# EAGLE design CANShield (EAGLE 7.3.0)

## Sheet 1 of 10
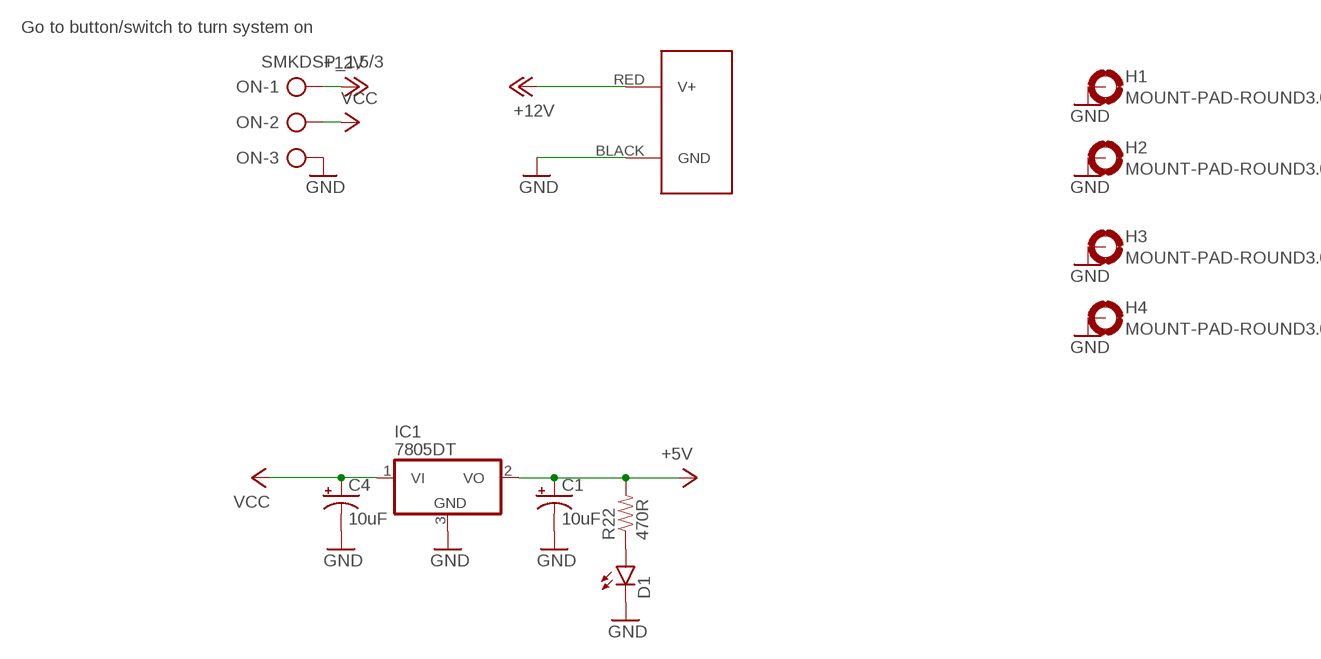
[diagram p0: schematic, sheet 1]

### Parts
C1  10uF  CAP_POLC  [PANASONIC_C]
C4  10uF  CAP_POLC  [PANASONIC_C]
D1  LED1206  [LED-1206]
H1  MOUNT-PAD-ROUND3.0  [3,0-PAD]
H2  MOUNT-PAD-ROUND3.0  [3,0-PAD]
H3  MOUNT-PAD-ROUND3.0  [3,0-PAD]
H4  MOUNT-PAD-ROUND3.0  [3,0-PAD]
IC1  7805DT  [TO252]
J2  POWERPOLE_POWER25A_HORIZONTAL_G2  [POWERPOLE_PAIR_25A_HORIZ_G2]
ON  SMKDSP_1,5/3  [SMKDSP_1,5/3]
R22  470R  RESISTOR0603-RES  [0603-RES]

### Nets
+5V: C1.+ IC1.2(VO) R22.2 ; also sheet 2,3,4,6,7,9,10
+12V: J2.RED(V+) ON.1 ; also sheet 3,5,8,10
GND: C1.- C4.- D1.C H1.B3,0(MOUNT) H2.B3,0(MOUNT) H3.B3,0(MOUNT) H4.B3,0(MOUNT) IC1.3(GND) J2.BLACK(GND) ON.3 ; also sheet 2,3,4,5,6,7,8,9,10
N$16: D1.A R22.1
VCC: C4.+ IC1.1(VI) ON.2

### Notes on the sheet
- Go to button/switch to turn system on

## Sheet 2 of 10
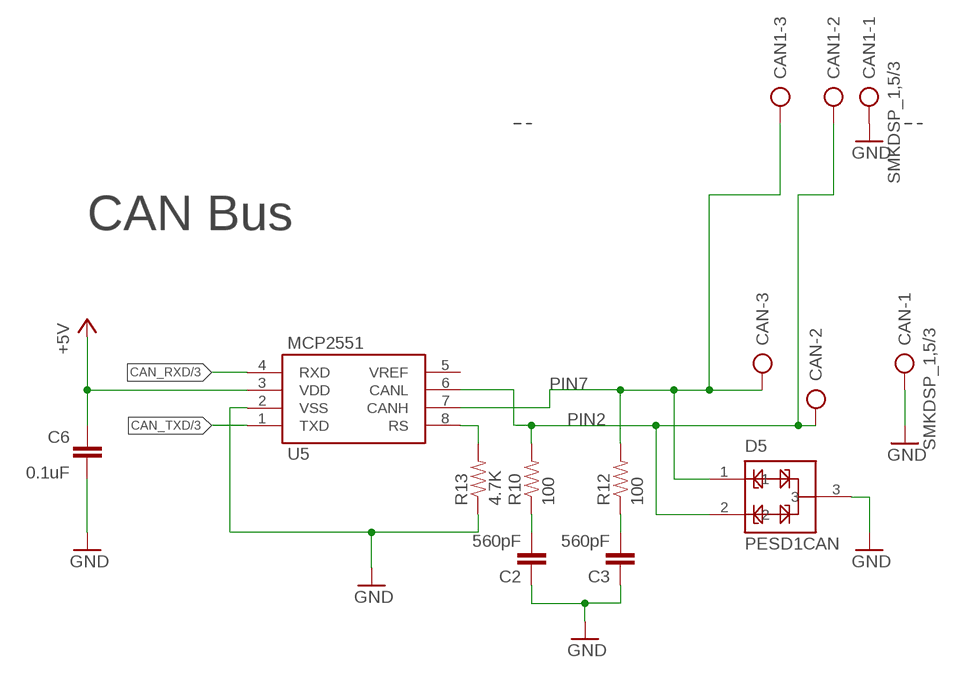
[diagram p1: schematic, sheet 2]

### Parts
C2  560pF  560PF-50V-5%(0603)  [0603-CAP]
C3  560pF  560PF-50V-5%(0603)  [0603-CAP]
C6  0.1uF  0.1UF-25V(+80/-20%)(0603)  [0603-CAP]
CAN  SMKDSP_1,5/3  [SMKDSP_1,5/3]
CAN1  SMKDSP_1,5/3  [SMKDSP_1,5/3]
D5  PESD1CAN  [SOT23-3@1]
R10  100  100OHM-1/10W-1%(0603)  [0603-RES@1]
R12  100  100OHM-1/10W-1%(0603)  [0603-RES@1]
R13  4.7K  4.7KOHM-1/10W-1%(0603)  [0603-RES@1]
U5  MCP2551  [SO08]

### Nets
+5V: C6.2 U5.3(VDD) ; also sheet 1,3,4,6,7,9,10
CAN_RXD: U5.4(RXD) ; also sheet 3
CAN_TXD: U5.1(TXD) ; also sheet 3
GND: C2.1 C3.1 C6.1 CAN1.1 CAN.1 D5.3 R13.1 U5.2(VSS) ; also sheet 1,3,4,5,6,7,8,9,10
N$9: C2.2 R10.1
N$10: C3.2 R12.1
N$14: R13.2 U5.8(RS)
PIN2: CAN1.2 CAN.2 D5.2 R10.2 U5.6(CANL)
PIN7: CAN1.3 CAN.3 D5.1 R12.2 U5.7(CANH)
Unconnected: U5.5(VREF)

### Notes on the sheet
- CAN Bus

## Sheet 3 of 10
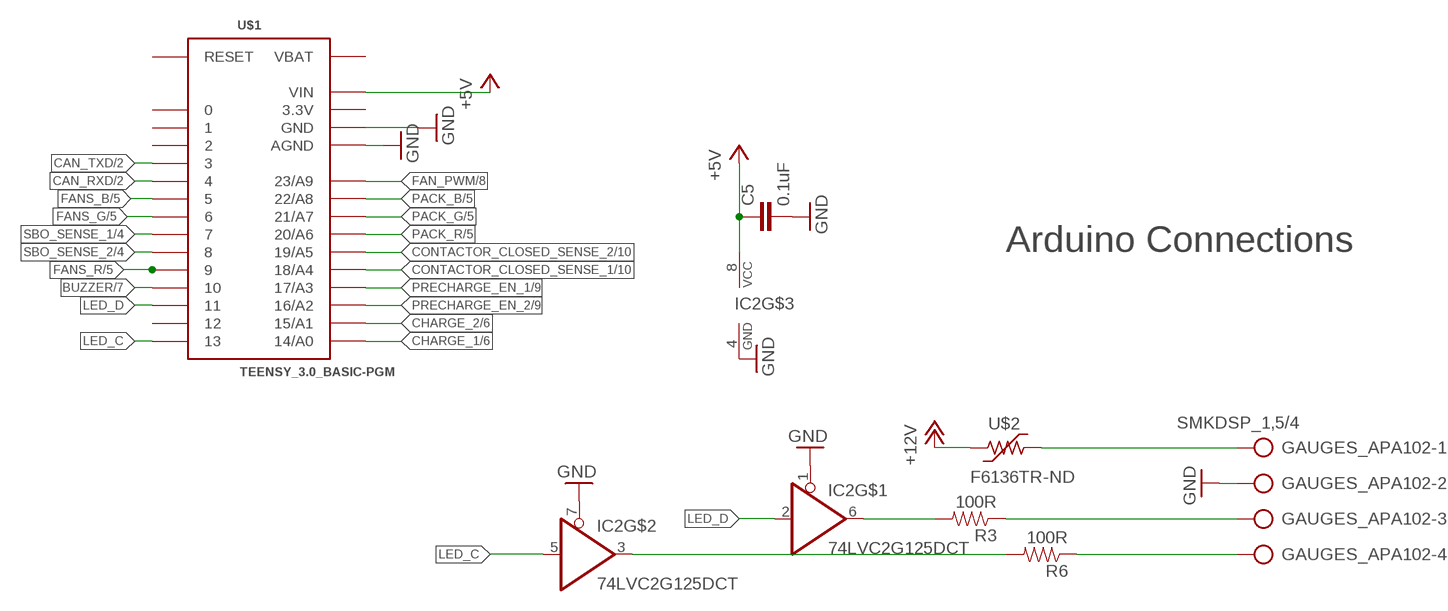
[diagram p2: schematic, sheet 3]

### Parts
C5  0.1uF  CAP0603-CAP  [0603-CAP]
GAUGES_APA102  SMKDSP_1,5/4  [SMKDSP_1,5/4]
IC2  74LVC2G125DCT  [SSOP08]
R3  100R  RESISTOR0603-RES  [0603-RES]
R6  100R  RESISTOR0603-RES  [0603-RES]
U$1  TEENSY_3.0_BASIC-PGM  [TEENSY_3.0_BASIC-PGM]
U$2  F6136TR-ND  PTC-2920L  [2920L]

### Nets
+5V: C5.1 IC2.8(VCC) U$1.VIN ; also sheet 1,2,4,6,7,9,10
+12V: U$2.1 ; also sheet 1,5,8,10
BUZZER: U$1.10 ; also sheet 7
CAN_RXD: U$1.4 ; also sheet 2
CAN_TXD: U$1.3 ; also sheet 2
CHARGE_1: U$1.14/A0 ; also sheet 6
CHARGE_2: U$1.15/A1 ; also sheet 6
CONTACTOR_CLOSED_SENSE_1: U$1.18/A4 ; also sheet 10
CONTACTOR_CLOSED_SENSE_2: U$1.19/A5 ; also sheet 10
FAN_PWM: U$1.23/A9 ; also sheet 8
FANS_B: U$1.5 ; also sheet 5
FANS_G: U$1.6 ; also sheet 5
FANS_R: U$1.9 ; also sheet 5
GND: C5.2 GAUGES_APA102.2 IC2.1(OE) IC2.4(GND) IC2.7(OE) U$1.AGND U$1.GND U$1.GND1(GND) ; also sheet 1,2,4,5,6,7,8,9,10
LED_C: IC2.5(I) U$1.13
LED_D: IC2.2(I) U$1.11
N$2: IC2.3(O) R6.2
N$3: GAUGES_APA102.3 R3.1
N$5: GAUGES_APA102.4 R6.1
N$17: IC2.6(O) R3.2
N$29: GAUGES_APA102.1 U$2.2
PACK_B: U$1.22/A8 ; also sheet 5
PACK_G: U$1.21/A7 ; also sheet 5
PACK_R: U$1.20/A6 ; also sheet 5
PRECHARGE_EN_1: U$1.17/A3 ; also sheet 9
PRECHARGE_EN_2: U$1.16/A2 ; also sheet 9
SBO_SENSE_1: U$1.7 ; also sheet 4
SBO_SENSE_2: U$1.8 ; also sheet 4
Unconnected: U$1.0 U$1.1 U$1.2 U$1.12 U$1.RESET

### Notes on the sheet
- Arduino Connections

## Sheet 4 of 10
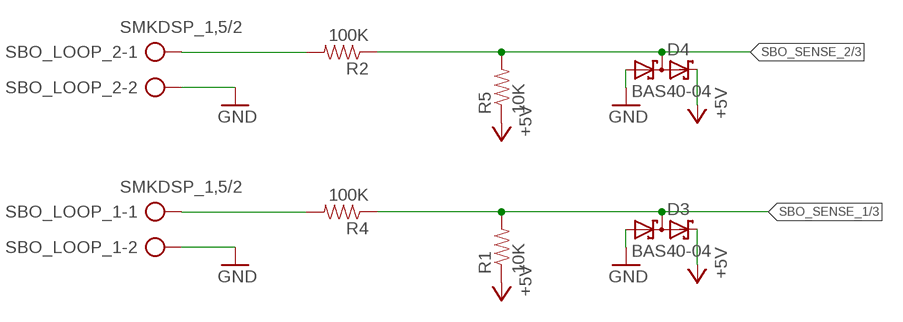
[diagram p3: schematic, sheet 4]

### Parts
D3  BAS40-04  [SOT23]
D4  BAS40-04  [SOT23]
R1  10K  RESISTOR0603-RES  [0603-RES]
R2  100K  RESISTOR0603-RES  [0603-RES]
R4  100K  RESISTOR0603-RES  [0603-RES]
R5  10K  RESISTOR0603-RES  [0603-RES]
SBO_LOOP_1  SMKDSP_1,5/2  [SMKDSP_1,5/2]
SBO_LOOP_2  SMKDSP_1,5/2  [SMKDSP_1,5/2]

### Nets
+5V: D3.2(C2) D4.2(C2) R1.1 R5.1 ; also sheet 1,2,3,6,7,9,10
GND: D3.1(A1) D4.1(A1) SBO_LOOP_1.2 SBO_LOOP_2.2 ; also sheet 1,2,3,5,6,7,8,9,10
N$1: R2.2 SBO_LOOP_2.1
N$4: R4.2 SBO_LOOP_1.1
SBO_SENSE_1: D3.3(C1A2) R1.2 R4.1 ; also sheet 3
SBO_SENSE_2: D4.3(C1A2) R2.1 R5.2 ; also sheet 3

## Sheet 5 of 10
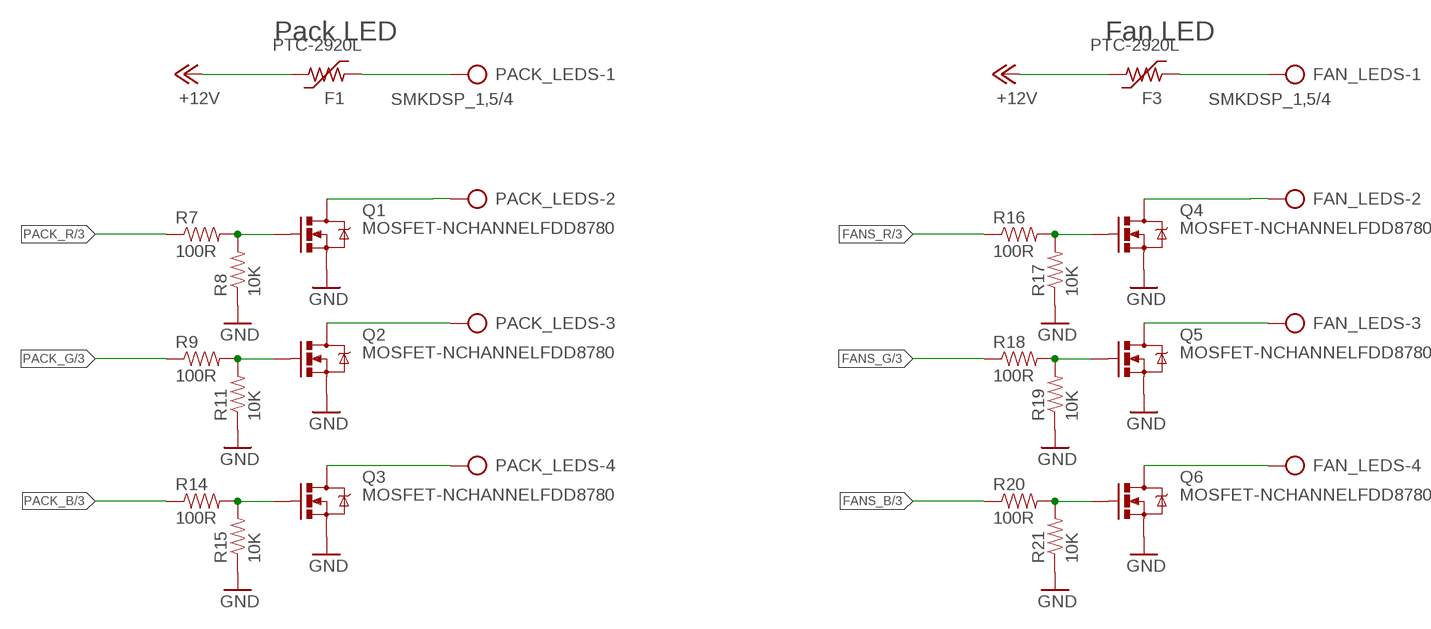
[diagram p4: schematic, sheet 5]

### Parts
F1  PTC-2920L  [2920L]
F3  PTC-2920L  [2920L]
FAN_LEDS  SMKDSP_1,5/4  [SMKDSP_1,5/4]
PACK_LEDS  SMKDSP_1,5/4  [SMKDSP_1,5/4]
Q1  MOSFET-NCHANNELFDD8780  [DPAK]
Q2  MOSFET-NCHANNELFDD8780  [DPAK]
Q3  MOSFET-NCHANNELFDD8780  [DPAK]
Q4  MOSFET-NCHANNELFDD8780  [DPAK]
Q5  MOSFET-NCHANNELFDD8780  [DPAK]
Q6  MOSFET-NCHANNELFDD8780  [DPAK]
R7  100R  RESISTOR0603-RES  [0603-RES]
R8  10K  RESISTOR0603-RES  [0603-RES]
R9  100R  RESISTOR0603-RES  [0603-RES]
R11  10K  RESISTOR0603-RES  [0603-RES]
R14  100R  RESISTOR0603-RES  [0603-RES]
R15  10K  RESISTOR0603-RES  [0603-RES]
R16  100R  RESISTOR0603-RES  [0603-RES]
R17  10K  RESISTOR0603-RES  [0603-RES]
R18  100R  RESISTOR0603-RES  [0603-RES]
R19  10K  RESISTOR0603-RES  [0603-RES]
R20  100R  RESISTOR0603-RES  [0603-RES]
R21  10K  RESISTOR0603-RES  [0603-RES]

### Nets
+12V: F1.2 F3.2 ; also sheet 1,3,8,10
FANS_B: R20.1 ; also sheet 3
FANS_G: R18.1 ; also sheet 3
FANS_R: R16.1 ; also sheet 3
GND: Q1.3(S) Q2.3(S) Q3.3(S) Q4.3(S) Q5.3(S) Q6.3(S) R8.1 R11.1 R15.1 R17.1 R19.1 R21.1 ; also sheet 1,2,3,4,6,7,8,9,10
N$6: PACK_LEDS.2 Q1.4(D)
N$7: F1.1 PACK_LEDS.1
N$8: PACK_LEDS.3 Q2.4(D)
N$11: PACK_LEDS.4 Q3.4(D)
N$12: Q1.1(G) R7.2 R8.2
N$13: Q2.1(G) R9.2 R11.2
N$15: Q3.1(G) R14.2 R15.2
N$19: F3.1 FAN_LEDS.1
N$20: FAN_LEDS.2 Q4.4(D)
N$21: FAN_LEDS.3 Q5.4(D)
N$22: FAN_LEDS.4 Q6.4(D)
N$23: Q4.1(G) R16.2 R17.2
N$24: Q5.1(G) R18.2 R19.2
N$25: Q6.1(G) R20.2 R21.2
PACK_B: R14.1 ; also sheet 3
PACK_G: R9.1 ; also sheet 3
PACK_R: R7.1 ; also sheet 3

### Notes on the sheet
- Pack LED | Fan LED

## Sheet 6 of 10
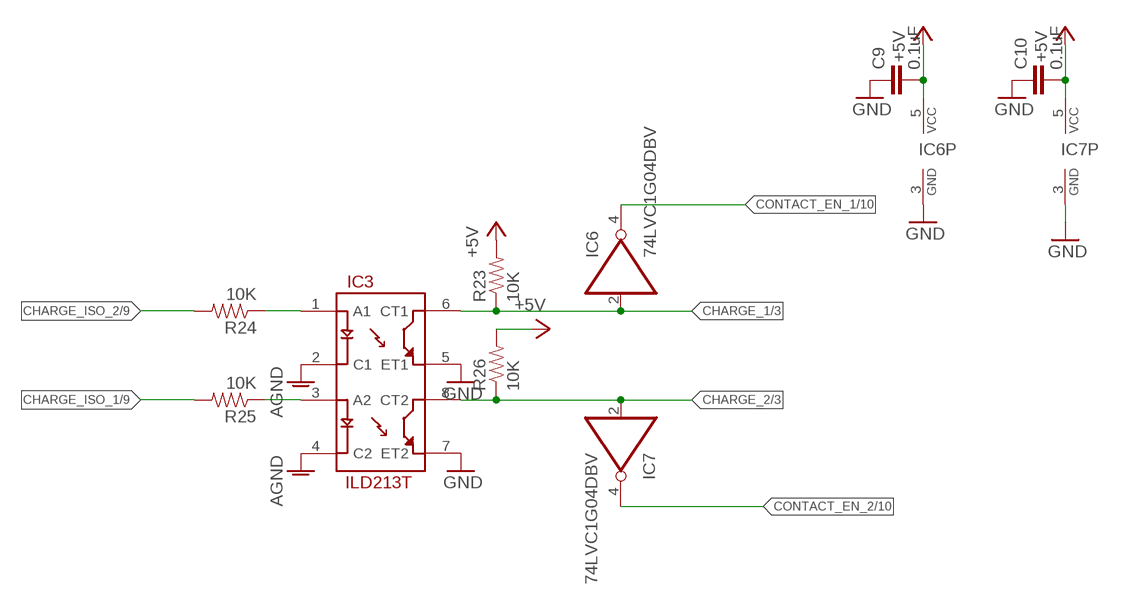
[diagram p5: schematic, sheet 6]

### Parts
C9  0.1uF  CAP0603-CAP  [0603-CAP]
C10  0.1uF  CAP0603-CAP  [0603-CAP]
IC3  ILD213T  [SO08]
IC6  74LVC1G04DBV  [SOT23-5]
IC7  74LVC1G04DBV  [SOT23-5]
R23  10K  RESISTOR0603-RES  [0603-RES]
R24  10K  RESISTOR0603-RES  [0603-RES]
R25  10K  RESISTOR0603-RES  [0603-RES]
R26  10K  RESISTOR0603-RES  [0603-RES]

### Nets
+5V: C9.2 C10.2 IC6.5(VCC) IC7.5(VCC) R23.2 R26.2 ; also sheet 1,2,3,4,7,9,10
AGND: IC3.2(C1) IC3.4(C2) ; also sheet 9
CHARGE_1: IC3.6(CT1) IC6.2(I) R23.1 ; also sheet 3
CHARGE_2: IC3.8(CT2) IC7.2(I) R26.1 ; also sheet 3
CHARGE_ISO_1: R25.2 ; also sheet 9
CHARGE_ISO_2: R24.2 ; also sheet 9
CONTACT_EN_1: IC6.4(O) ; also sheet 10
CONTACT_EN_2: IC7.4(O) ; also sheet 10
GND: C9.1 C10.1 IC3.5(ET1) IC3.7(ET2) IC6.3(GND) IC7.3(GND) ; also sheet 1,2,3,4,5,7,8,9,10
N$32: IC3.3(A2) R25.1
N$34: IC3.1(A1) R24.1

## Sheet 7 of 10
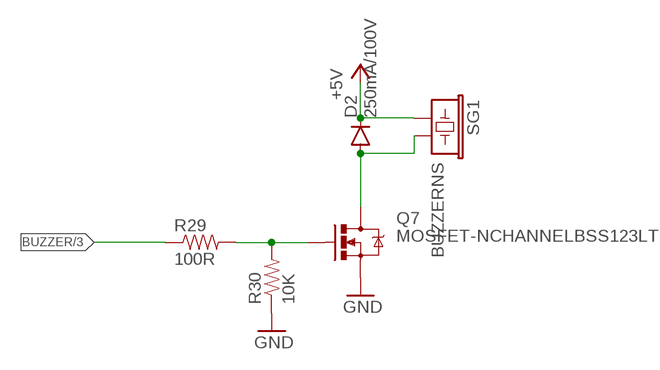
[diagram p6: schematic, sheet 7]

### Parts
D2  250mA/100V  DIODEBAS16  [SOD-323]
Q7  MOSFET-NCHANNELBSS123LT1G  [SOT23]
R29  100R  RESISTOR0603-RES  [0603-RES]
R30  10K  RESISTOR0603-RES  [0603-RES]
SG1  BUZZERNS  [BUZZER-12MM-NS]

### Nets
+5V: D2.C SG1.+ ; also sheet 1,2,3,4,6,9,10
BUZZER: R29.1 ; also sheet 3
GND: Q7.2(S) R30.1 ; also sheet 1,2,3,4,5,6,8,9,10
N$18: D2.A Q7.3(D) SG1.-
N$26: Q7.1(G) R29.2 R30.2

## Sheet 8 of 10
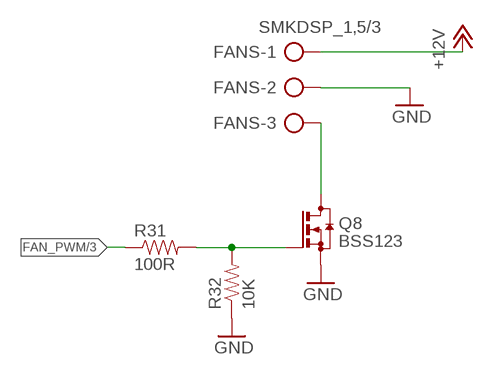
[diagram p7: schematic, sheet 8]

### Parts
FANS  SMKDSP_1,5/3  [SMKDSP_1,5/3]
Q8  BSS123  [SOT23]
R31  100R  RESISTOR0603-RES  [0603-RES]
R32  10K  RESISTOR0603-RES  [0603-RES]

### Nets
+12V: FANS.1 ; also sheet 1,3,5,10
FAN_PWM: R31.1 ; also sheet 3
GND: FANS.2 Q8.2(S) R32.1 ; also sheet 1,2,3,4,5,6,7,9,10
N$27: Q8.1(G) R31.2 R32.2
N$28: FANS.3 Q8.3(D)

## Sheet 9 of 10
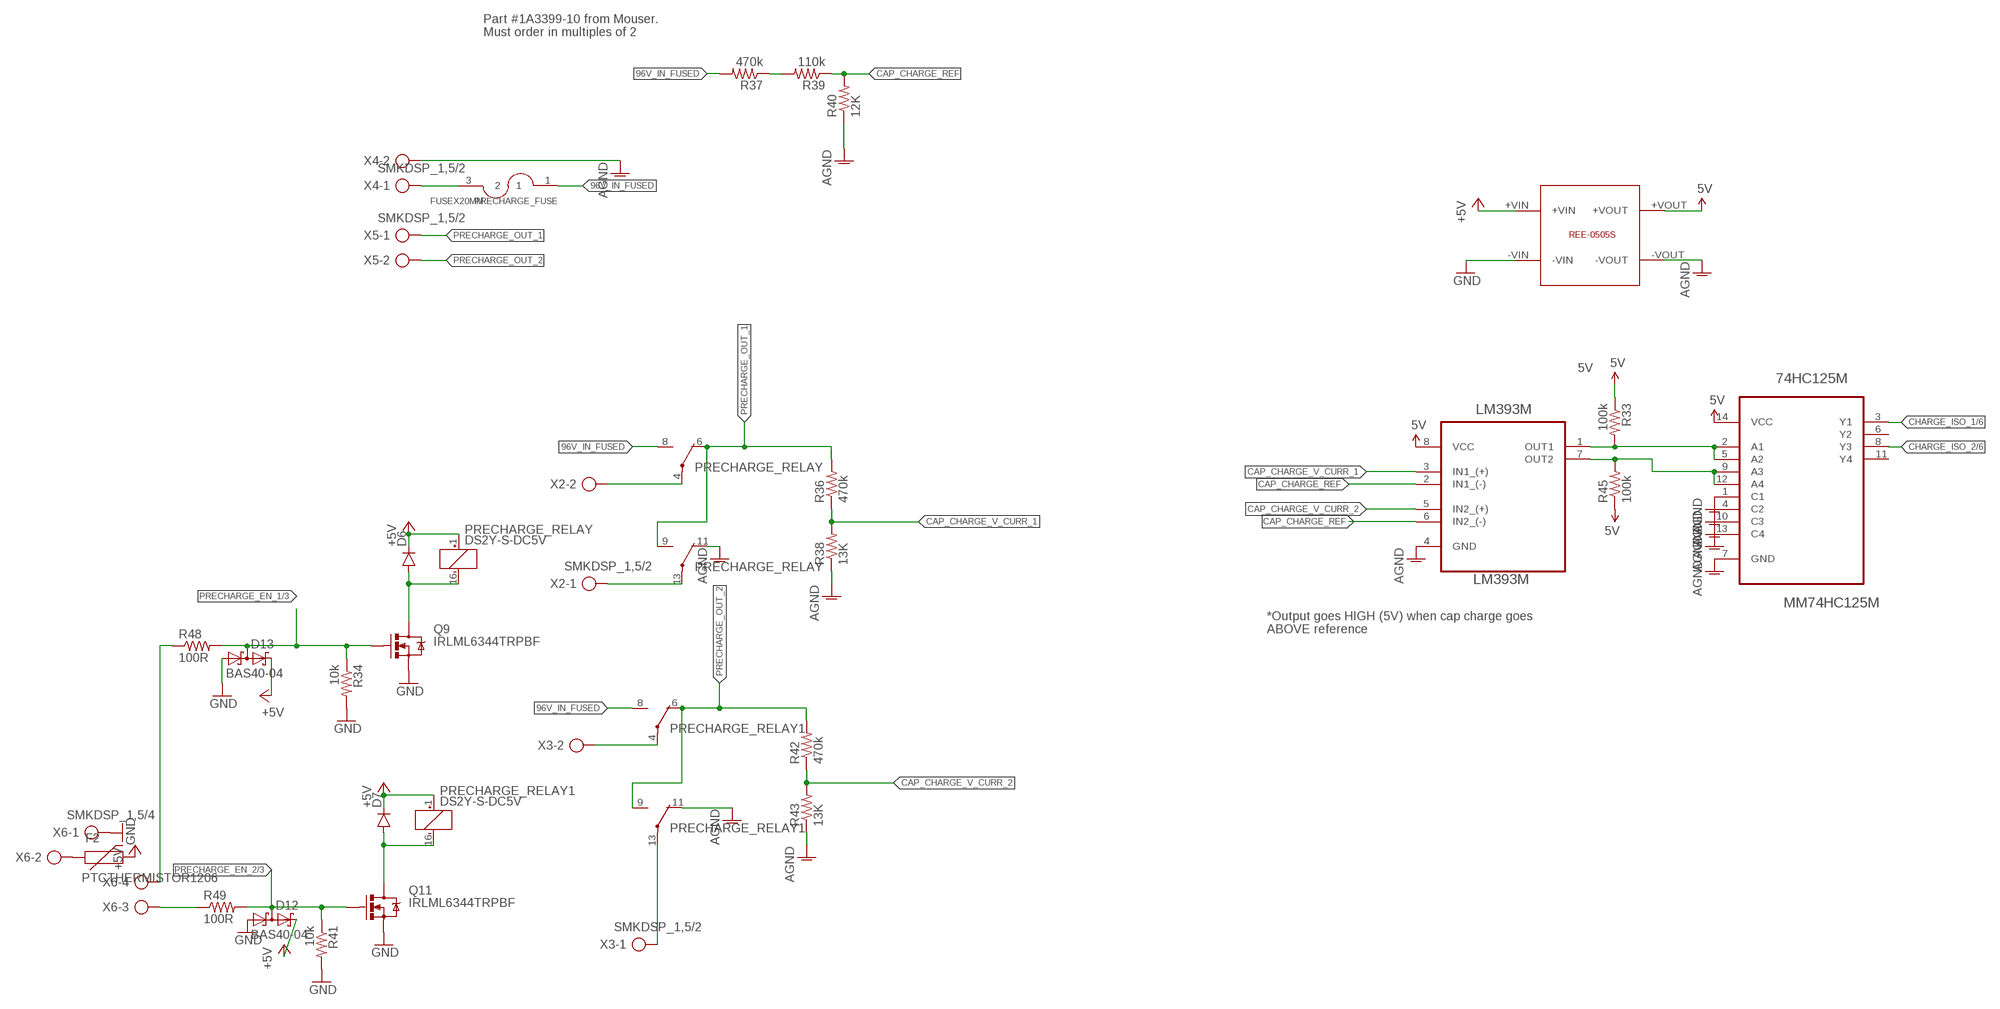
[diagram p8: schematic, sheet 9]

### Parts
74HC125M  MM74HC125M  [SOIC127P600X175-14N]
D6  DIODESOD123  [SOD-123]
D7  DIODESOD123  [SOD-123]
D12  BAS40-04  [SOT23]
D13  BAS40-04  [SOT23]
F2  PTCTHERMISTOR1206  [PTC-1206]
LM393M  LM393M  [SOIC127P600X180-8N]
PRECHARGE_FUSE  FUSEX20MM  [FUSE_5MM]
PRECHARGE_RELAY  DS2Y-S-DC5V  [DS2Y]
PRECHARGE_RELAY1  DS2Y-S-DC5V  [DS2Y]
Q9  IRLML6344TRPBF  MOSFET-NCHANNELBSS123LT1G  [SOT23]
Q11  IRLML6344TRPBF  MOSFET-NCHANNELBSS123LT1G  [SOT23]
R33  100k  RESISTOR0603-RES  [0603-RES]
R34  10k  RESISTOR0603-RES  [0603-RES]
R36  470k  RESISTOR0805-RES  [0805]
R37  470k  RESISTOR0805-RES  [0805]
R38  13K  RESISTOR0805-RES  [0805]
R39  110k  RESISTOR0805-RES  [0805]
R40  12K  RESISTOR0805-RES  [0805]
R41  10k  RESISTOR0603-RES  [0603-RES]
R42  470k  RESISTOR0805-RES  [0805]
R43  13K  RESISTOR0805-RES  [0805]
R45  100k  RESISTOR0603-RES  [0603-RES]
R48  100R  RESISTOR0603-RES  [0603-RES]
R49  100R  RESISTOR0603-RES  [0603-RES]
U$5  REE-0505S  [REE-0505S]
X2  SMKDSP_1,5/2  [SMKDSP_1,5/2]
X3  SMKDSP_1,5/2  [SMKDSP_1,5/2]
X4  SMKDSP_1,5/2  [SMKDSP_1,5/2]
X5  SMKDSP_1,5/2  [SMKDSP_1,5/2]
X6  SMKDSP_1,5/4  [SMKDSP_1,5/4]

### Nets
5V: 74HC125M.14(VCC) LM393M.8(VCC) R33.1 R45.1 U$5.+VOUT
96V_IN_FUSED: PRECHARGE_FUSE.1 PRECHARGE_RELAY1.8(2:S) PRECHARGE_RELAY.8(2:S) R37.2
+5V: D6.C D7.C D12.2(C2) D13.2(C2) F2.2 PRECHARGE_RELAY1.1(1:+) PRECHARGE_RELAY.1(1:+) U$5.+VIN ; also sheet 1,2,3,4,6,7,10
AGND: 74HC125M.1(C1) 74HC125M.4(C2) 74HC125M.7(GND) 74HC125M.10(C3) 74HC125M.13(C4) LM393M.4(GND) PRECHARGE_RELAY1.11(3:O) PRECHARGE_RELAY.11(3:O) R38.1 R40.1 R43.1 U$5.-VOUT X4.2 ; also sheet 6
CAP_CHARGE_REF: LM393M.2(IN1_(-)) LM393M.6(IN2_(-)) R39.1 R40.2
CAP_CHARGE_V_CURR_1: LM393M.3(IN1_(+)) R36.1 R38.2
CAP_CHARGE_V_CURR_2: LM393M.5(IN2_(+)) R42.1 R43.2
CHARGE_ISO_1: 74HC125M.3(Y1) ; also sheet 6
CHARGE_ISO_2: 74HC125M.8(Y3) ; also sheet 6
GND: D12.1(A1) D13.1(A1) Q9.2(S) Q11.2(S) R34.2 R41.2 U$5.-VIN X6.1 ; also sheet 1,2,3,4,5,6,7,8,10
N$30: R37.1 R39.2
N$31: 74HC125M.9(A3) 74HC125M.12(A4) LM393M.7(OUT2) R45.2
N$36: R48.1 X6.4
N$37: R49.1 X6.3
N$40: PRECHARGE_RELAY.13(3:P) X2.1
N$41: PRECHARGE_RELAY1.13(3:P) X3.1
N$42: PRECHARGE_FUSE.3 X4.1
N$47: F2.1 X6.2
PRECH_DRAIN: D6.A PRECHARGE_RELAY.16(1:-) Q9.3(D)
PRECH_DRAIN1: D7.A PRECHARGE_RELAY1.16(1:-) Q11.3(D)
PRECH_STATE_TO_BUFF: 74HC125M.2(A1) 74HC125M.5(A2) LM393M.1(OUT1) R33.2
PRECHARGE_EN_1: D13.3(C1A2) Q9.1(G) R34.1 R48.2 ; also sheet 3
PRECHARGE_EN_2: D12.3(C1A2) Q11.1(G) R41.1 R49.2 ; also sheet 3
PRECHARGE_OUT_1: PRECHARGE_RELAY.6(2:O) PRECHARGE_RELAY.9(3:S) R36.2 X5.1
PRECHARGE_OUT_2: PRECHARGE_RELAY1.6(2:O) PRECHARGE_RELAY1.9(3:S) R42.2 X5.2
PRECHARGE_RESISTOR_IN_1: PRECHARGE_RELAY.4(2:P) X2.2
PRECHARGE_RESISTOR_IN_2: PRECHARGE_RELAY1.4(2:P) X3.2
Unconnected: 74HC125M.6(Y2) 74HC125M.11(Y4)

### Notes on the sheet
- Part #1A3399-10 from Mouser. 
  Must order in multiples of 2
- *Output goes HIGH (5V) when cap charge goes
  ABOVE reference

## Sheet 10 of 10
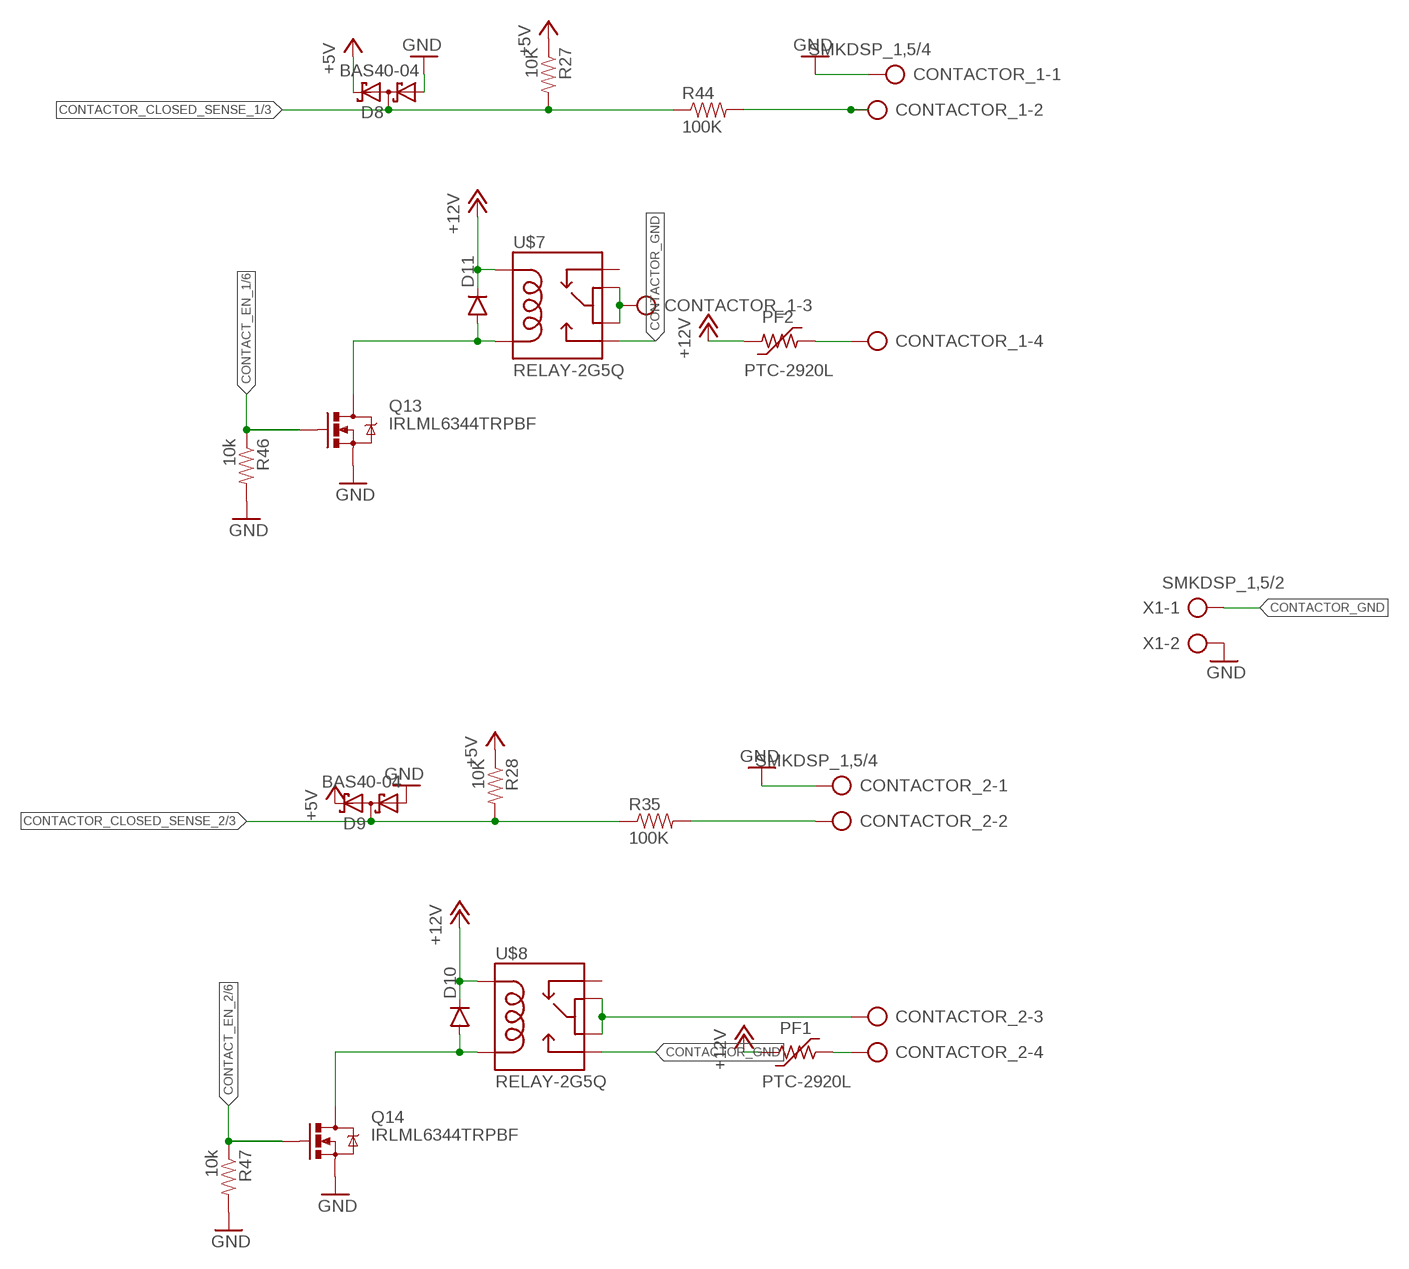
[diagram p9: schematic, sheet 10]

### Parts
CONTACTOR_1  SMKDSP_1,5/4  [SMKDSP_1,5/4]
CONTACTOR_2  SMKDSP_1,5/4  [SMKDSP_1,5/4]
D8  BAS40-04  [SOT23]
D9  BAS40-04  [SOT23]
D10  DIODESOD123  [SOD-123]
D11  DIODESOD123  [SOD-123]
PF1  PTC-2920L  [2920L]
PF2  PTC-2920L  [2920L]
Q13  IRLML6344TRPBF  MOSFET-NCHANNELBSS123LT1G  [SOT23]
Q14  IRLML6344TRPBF  MOSFET-NCHANNELBSS123LT1G  [SOT23]
R27  10K  RESISTOR0603-RES  [0603-RES]
R28  10K  RESISTOR0603-RES  [0603-RES]
R35  100K  RESISTOR0603-RES  [0603-RES]
R44  100K  RESISTOR0603-RES  [0603-RES]
R46  10k  RESISTOR0603-RES  [0603-RES]
R47  10k  RESISTOR0603-RES  [0603-RES]
U$7  RELAY-2G5Q  [RELAY-G5V]
U$8  RELAY-2G5Q  [RELAY-G5V]
X1  SMKDSP_1,5/2  [SMKDSP_1,5/2]

### Nets
+5V: D8.2(C2) D9.2(C2) R27.1 R28.1 ; also sheet 1,2,3,4,6,7,9
+12V: D10.C D11.C PF1.1 PF2.1 U$7.2 U$8.2 ; also sheet 1,3,5,8
CONTACT_EN_1: Q13.1(G) R46.1 ; also sheet 6
CONTACT_EN_2: Q14.1(G) R47.1 ; also sheet 6
CONTACTOR_CLOSED_SENSE_1: D8.3(C1A2) R27.2 R44.1 ; also sheet 3
CONTACTOR_CLOSED_SENSE_2: D9.3(C1A2) R28.2 R35.1 ; also sheet 3
CONTACTOR_GND: U$7.10 U$8.10 X1.1
GND: CONTACTOR_1.1 CONTACTOR_2.1 D8.1(A1) D9.1(A1) Q13.2(S) Q14.2(S) R46.2 R47.2 X1.2 ; also sheet 1,2,3,4,5,6,7,8,9
N$33: D10.A Q14.3(D) U$8.9
N$35: D11.A Q13.3(D) U$7.9
N$38: CONTACTOR_1.3 U$7.5 U$7.6
N$39: CONTACTOR_2.3 U$8.5 U$8.6
N$43: CONTACTOR_1.4 PF2.2
N$44: CONTACTOR_2.4 PF1.2
N$45: CONTACTOR_2.2 R35.2
N$46: CONTACTOR_1.2 R44.2
Unconnected: U$7.1 U$8.1

## Power pins joined to a net without a drawn wire
3.3V: U$1.3.3V U$1.3.3V1(3.3V)
VBAT: U$1.VBAT

## Library data of the parts
74HC125M = Fairchild_By_element14_Batch_1:MM74HC125M: 3-STATE Quad Buffers; MPN: MM74HC125M; OC_FARNELL: 1013962; OC_NEWARK: 78K6059; PACKAGE: SOIC-14; SUPPLIER: Fairchild
C1 C4 = SparkFun-Capacitors:CAP_POL: Capacitor Polarized These are standard SMD and PTH capacitors. Normally 10uF, 47uF, and 100uF in electrolytic and tantalum varieties. Always verify the external diameter of the through hole cap, it varies with capacity, voltage, and manufacturer. The EIA devices should be standard.
C2 C3 = SparkFun-Capacitors:560PF-50V-5%(0603): CAP-08749; PROD_ID: CAP-08749
C5 C9 C10 = SparkFun-Capacitors:CAP: Capacitor Standard 0603 ceramic capacitor, and 0.1" leaded capacitor.
C6 = SparkFun-Capacitors:0.1UF-25V(+80/-20%)(0603): CAP-00810 Ceramic Standard decoupling cap; PROD_ID: CAP-00810
CAN CAN1 FANS ON = con-phoenix-smkdsp:SMKDSP_1,5/3: Printklemme, Nennstrom: 17,5 A, Bemessungsspannung: 250 V, Raster: 5,0 mm Source: http://eshop.phoenixcontact.de .. 1733415.pdf; MF: FARNELL; MPN: 1733583; OC_FARNELL: 3041256; OC_NEWARK: 71C4130
CONTACTOR_1 CONTACTOR_2 FAN_LEDS GAUGES_APA102 PACK_LEDS X6 = con-phoenix-smkdsp:SMKDSP_1,5/4: Printklemme, Nennstrom: 17,5 A, Bemessungsspannung: 250 V, Raster: 5,0 mm Source: http://eshop.phoenixcontact.de .. 1733415.pdf; MF: FARNELL; MPN: 1733596; OC_FARNELL: 3041268; OC_NEWARK: 71C4131
D1 = SparkFun-LED:LED: LEDs Standard schematic elements and footprints for 5mm, 3mm, 1206, and 0603 sized LEDs. 5mm - Spark Fun Electronics SKU : COM-00529 (and others)
D2 = SparkFun-DiscreteSemi:DIODE: Diode These are standard reverse protection diodes and small signal diodes. SMA package can handle up to about 1A. SOD-323 can handle about 200mA. What the SOD-323 package when ordering, there are some mfgs out there that are 5-pin packages.; PROD_ID: DIO-09646
D3 D4 D8 D9 D12 D13 = diode:BAS40-04: Silicon Schottky Diodes General-purpose diode for high-speed switching
D5 = SparkFun-DiscreteSemi:PESD1CAN: PESD1CAN is used to protect two automotive CAN bus lines from ESD.; PROD_ID: DIO-12501
D6 D7 D10 D11 = SparkFun-DiscreteSemi:DIODE: Diode These are standard reverse protection diodes and small signal diodes. SMA package can handle up to about 1A. SOD-323 can handle about 200mA. What the SOD-323 package when ordering, there are some mfgs out there that are 5-pin packages.
F1 F3 PF1 PF2 U$2 = polyswitch:PTC-: POLYSWITCH Polyswitch Resetable Fuses
F2 = SparkFun-PowerIC:PTC: Resettable Fuse PTC Resettable Fuse. Spark Fun Electronics SKU : COM-08357; PROD_ID: RES-08585
H1-H4 = holes:MOUNT-PAD-ROUND: MOUNTING PAD, round
IC1 = linear:78*: Positive VOLTAGE REGULATOR Source: http://cache.national.com/ds/LM/LM78L05.pdf http://www.fairchildsemi.com/ds/LM/LM7805.pdf
IC2 = 74xx-little-de:74*2G125: Dual line drivers with 3-state outputs.
IC3 = SparkFun-DiscreteSemi:ILD213T: Dual optoisolator.
IC6 IC7 = 74xx-little-de:74*1G04: INVERTER Gate
J2 = powerpoles:POWERPOLE_POWER: Anderson Powerpole Power Connector using ameteur radio standard layout
LM393M = Fairchild_By_element14_Batch_1:LM393M: Dual Differential Comparator; MPN: LM393M; OC_FARNELL: 9487590; OC_NEWARK: 78K6008; PACKAGE: SO-8; SUPPLIER: FAIRCHILD SEMICONDUCTOR
PRECHARGE_FUSE = SparkFun-Passives:FUSE
PRECHARGE_RELAY PRECHARGE_RELAY1 = relay:DS2Y-S-DC*: MINIATURE RELAY NAiS Source: http://www.mew-europe.com/.. en_ds_61005_0023.pdf; MPN: DS2Y-S-DC5V; OC_FARNELL: unknown; OC_NEWARK: 13P3268
Q1-Q6 = SparkFun-DiscreteSemi:MOSFET-NCHANNEL: Common NMOSFET Parts MFG P/N Store ID Prod ID FDD8780 TRANS-09984 SI7820DN TRANS-11055 FDS6630A IC-08089 2N7002PW TRANS-11151 FQP30N06L COM-10213 TRANS-10060 BSS123LT1G TRANS-08345 BSS138 TRANS-00830 BS170 2N7000; PROD_ID: TRANS-09984
Q7 Q9 Q11 Q13 Q14 = SparkFun-DiscreteSemi:MOSFET-NCHANNEL: Common NMOSFET Parts MFG P/N Store ID Prod ID FDD8780 TRANS-09984 SI7820DN TRANS-11055 FDS6630A IC-08089 2N7002PW TRANS-11151 FQP30N06L COM-10213 TRANS-10060 BSS123LT1G TRANS-08345 BSS138 TRANS-00830 BS170 2N7000; PROD_ID: TRANS-08345
Q8 = transistor-small-signal:BSS123: N-CHANNEL MOS FET
R1-R9 R11 R14-R21 R27 R28 R33-R47 = SparkFun-Resistors:RESISTOR: Resistor Basic schematic elements and footprints for 0603, 1206, and PTH resistors.
R10 R12 = SparkFun-Resistors:100OHM-1/10W-1%(0603): RES-07863; PROD_ID: RES-07863
R13 = SparkFun-Resistors:4.7KOHM-1/10W-1%(0603): RES-07857; PROD_ID: RES-07857
R22-R26 R29-R32 R48 R49 = SparkFun-Passives:RESISTOR: Resistor Basic schematic elements and footprints for 0603, 1206, and PTH resistors.
SBO_LOOP_1 SBO_LOOP_2 X1-X5 = con-phoenix-smkdsp:SMKDSP_1,5/2: Printklemme, Nennstrom: 17,5 A, Bemessungsspannung: 250 V, Raster: 5,0 mm Source: http://eshop.phoenixcontact.de .. 1733415.pdf; MF: FARNELL; MPN: 1733570; OC_FARNELL: 3041244; OC_NEWARK: 69C8588
SG1 = SparkFun-Electromechanical:BUZZER: Buzzer 12mm Spark Fun Electronics SKU : Comp-Buzzer
U5 = SparkFun-DigitalIC:MCP2551: CAN transceiver; PROD_ID: IC-09907
U$1 = Teensy3.0:TEENSY_3.0_BASIC-PGM: Teensy 3.0 Board outline identical to other 'basic' version except that 'PGM' pin has been omitted. See '+4', 'AllAnalogPins", and 'AllPins' packages for additional pin holes, as needed.
U$5 = grant:REE-0505S
U$7 U$8 = SparkFun-Electromechanical:RELAY-2: SPDT relay (COM-00100)

## Board
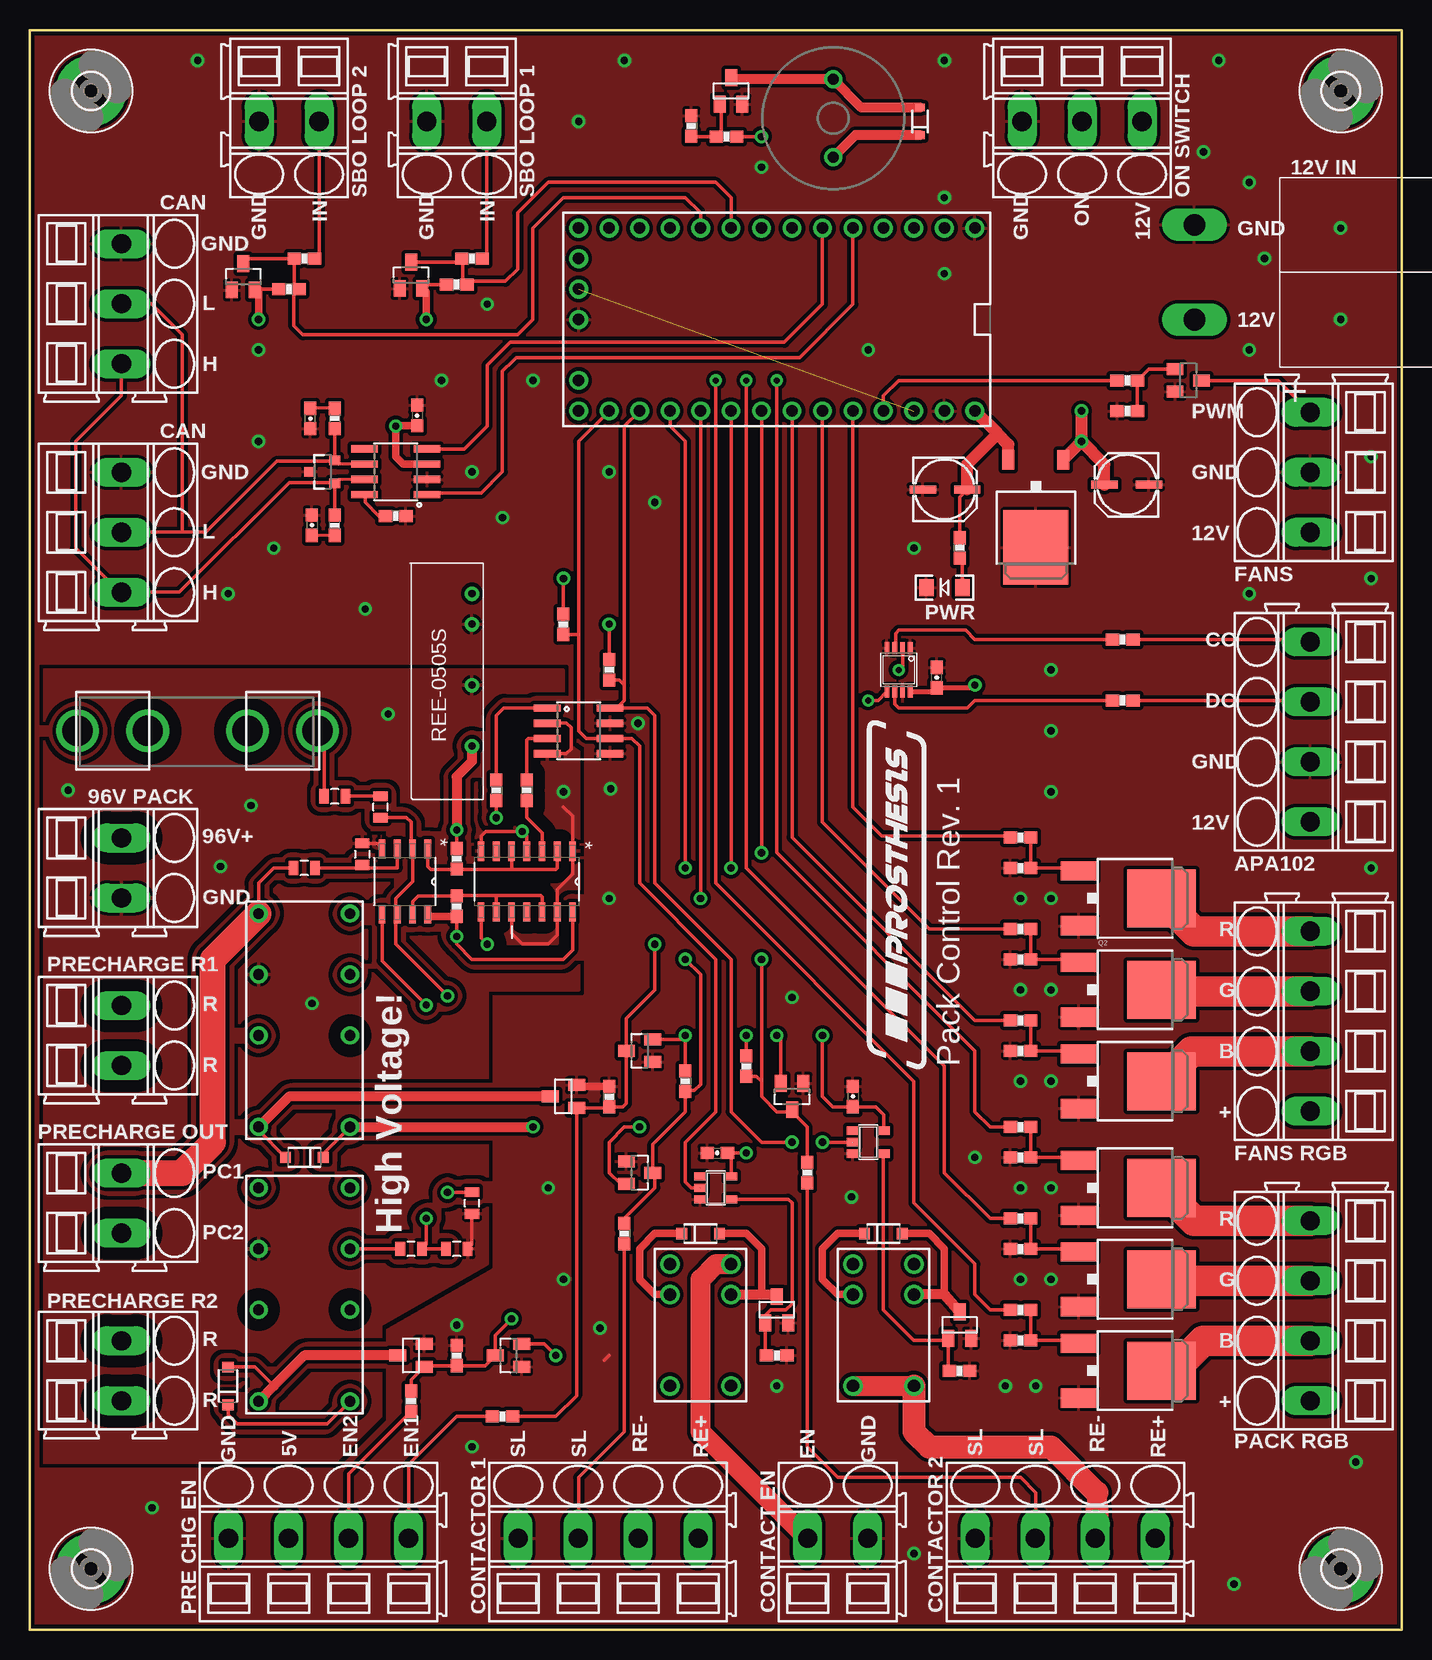
[diagram p10: board, top side]
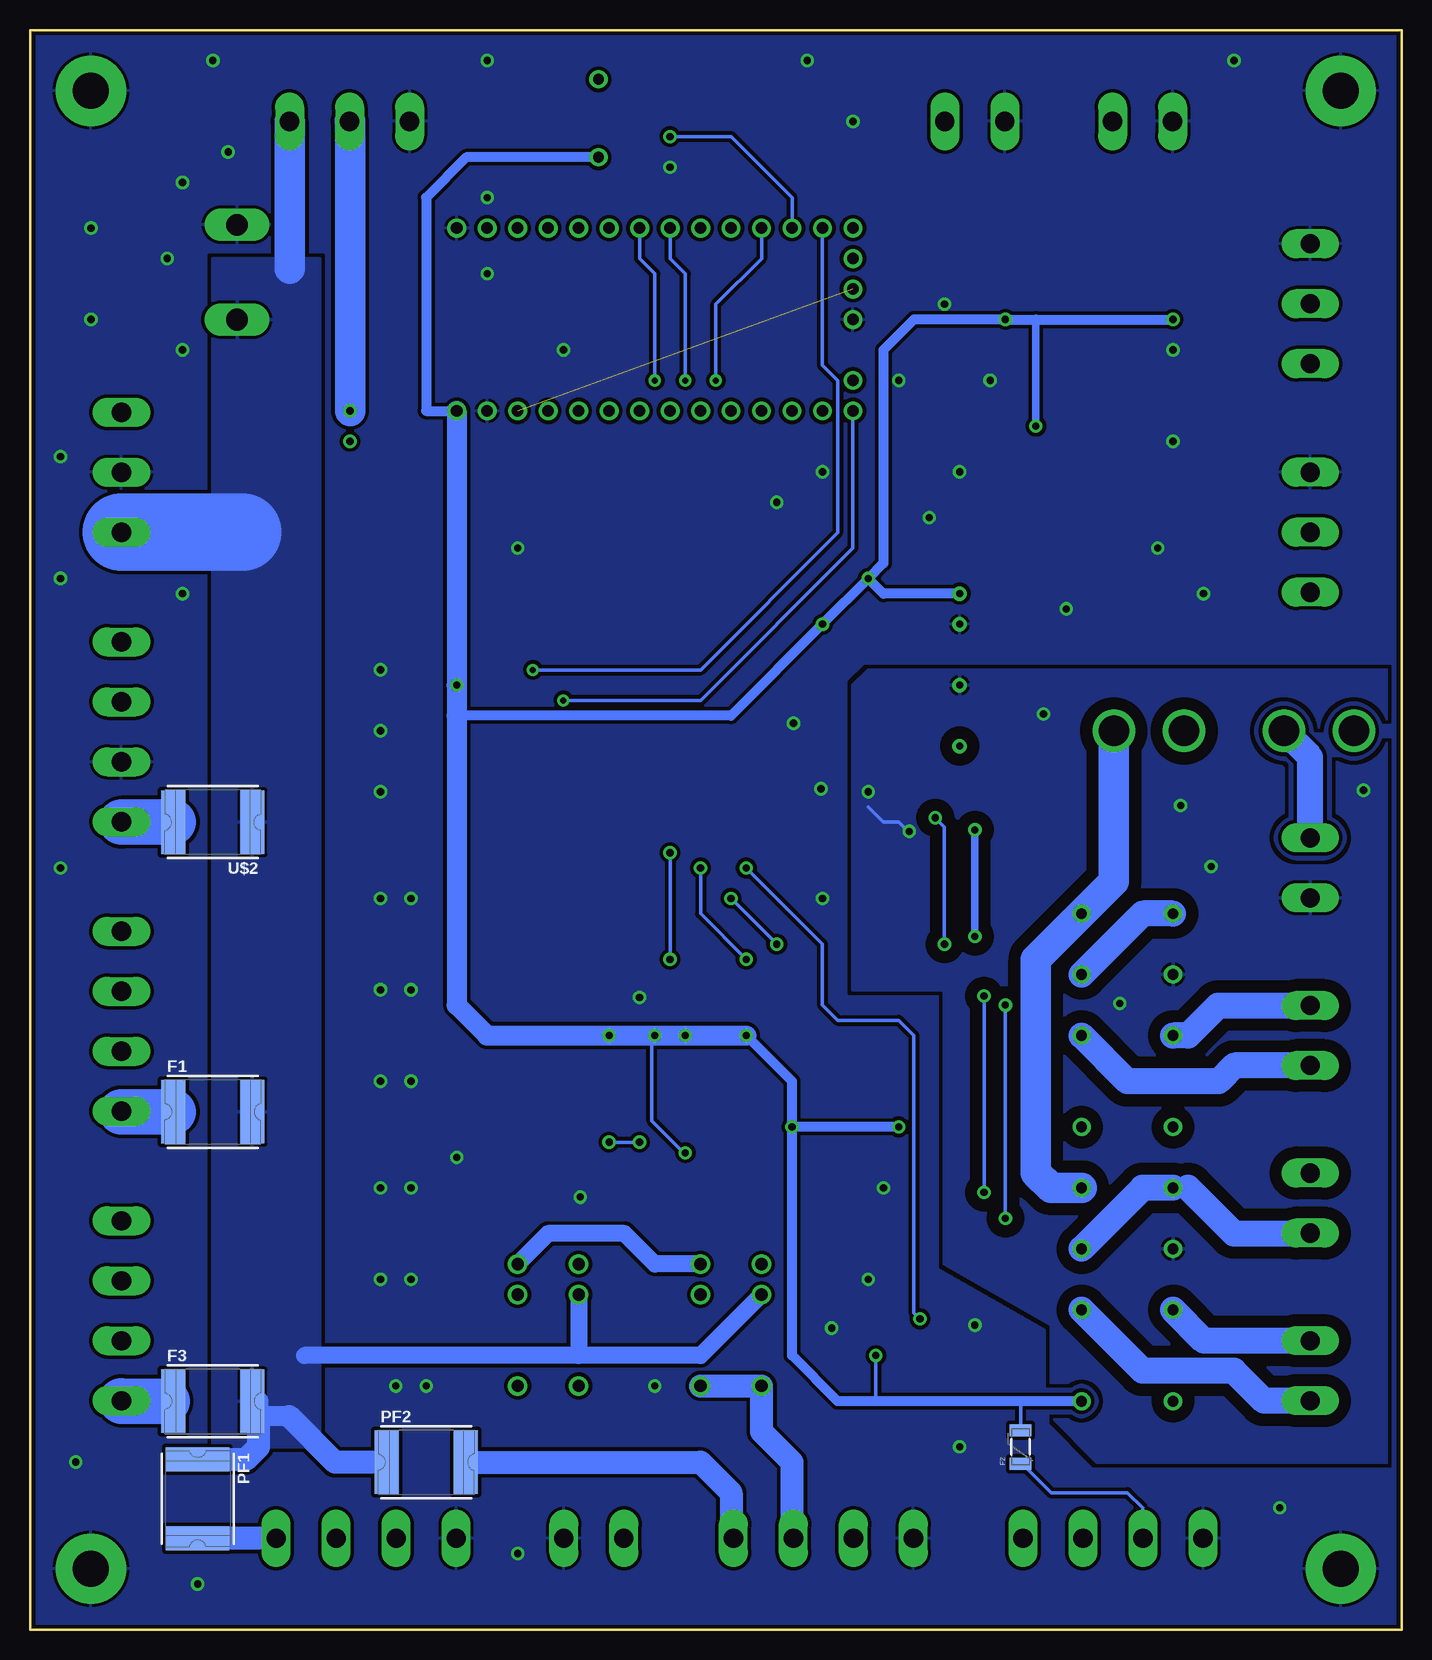
[diagram p11: board, bottom side, seen from below]

Size 114.3 x 133.35 mm. Coordinates in mm from the lower left corner, seen from the top.
Outline: 0,0 0,133.35 114.3,133.35 114.3,0 0,0
Copper layers (1*16): Top 0.035mm / dielectric 1.5mm / Bottom 0.035mm
Design rules "SparkFun-2-layer": minimum track width 7mil, minimum drill 15mil, track to track 8mil, track to pad 8mil, pad to pad 8mil, via to via 8mil, smd to smd 8mil, copper to edge 8mil, drill to drill 8mil, minimum pad ring 12mil, minimum via ring 10mil, stop-mask expansion 4mil, vias tented up to drill 20mil, thermal gap 10mil

### Footprints (pad centres in the part's own frame; a part is rotated, then mirrored left to right if it is on the bottom)
SOIC127P600X175-14N = smd 1.6 x 0.559: 1 -2.54,3.81; 2 -2.54,2.54; 3 -2.54,1.27; 4 -2.54,0; 5 -2.54,-1.27; 6 -2.54,-2.54; 7 -2.54,-3.81; 8 2.54,-3.81; 9 2.54,-2.54; 10 2.54,-1.27; 11 2.54,0; 12 2.54,1.27; 13 2.54,2.54; 14 2.54,3.81
PANASONIC_C = smd 2.2 x 0.65: + 1.9,-0.2; - -1.8,-0.2
0603-CAP = smd 1.1 x 1: 1 -0.85,0; 2 0.85,0
SMKDSP_1,5/3 = drill 1.6 pad 1.8 long: 1 -2.5,0; 2 2.5,0; 3 7.5,0
SMKDSP_1,5/4 = drill 1.6 pad 1.8 long: 1 -2.5,0; 2 2.5,0; 3 7.5,0; 4 12.5,0
LED-1206 = smd 1.2 x 1.4: A -1.5,0; C 1.5,0
SOD-323 = smd 0.63 x 0.83: A 1.15,0; C -1.15,0
SOT23 = smd 1 x 1.4: 1 -0.95,-1.1; 2 0.95,-1.1; 3 0,1.1
SOT23-3@1 = smd 0.8 x 0.9: 1 -0.95,-1; 2 0.95,-1; 3 0,1.1
SOD-123 = smd 0.9 x 0.95: A 1.575,0; C -1.575,0
2920L = smd 2 x 5.3: 1 -3.3,0; 2 3.3,0
PTC-1206 = smd 1 x 1.8: 1 -1.4,0; 2 1.4,0
3,0-PAD = drill 3 pad 5.842: B3,0 0,0
TO252 = smd 1 x 1.6: 1 -2.28,-4.8; 2 2.28,-4.8 | smd 5.4 x 6.2: 3 0,2.5
SSOP08 = smd 0.4 x 1: 1 -0.975,-1.8; 2 -0.325,-1.8; 3 0.325,-1.8; 4 0.975,-1.8; 5 0.975,1.8; 6 0.325,1.8; 7 -0.325,1.8; 8 -0.975,1.8
SO08 = smd 0.61 x 2.21: 1 -1.905,-2.616; 2 -0.635,-2.616; 3 0.635,-2.616; 4 1.905,-2.616; 5 1.905,2.616; 6 0.635,2.616; 7 -0.635,2.616; 8 -1.905,2.616
SOT23-5 = smd 0.69 x 0.99: 1 -0.95,-1.29; 2 0,-1.29; 3 0.95,-1.29; 4 0.95,1.3; 5 -0.95,1.3
POWERPOLE_PAIR_25A_HORIZ_G2 = drill 1.8 long: BLACK -3.95,-7.1; RED 3.95,-7.1
SOIC127P600X180-8N = smd 1.422 x 0.559: 1 -2.794,1.905; 2 -2.794,0.635; 3 -2.794,-0.635; 4 -2.794,-1.905; 5 2.794,-1.905; 6 2.794,-0.635; 7 2.794,0.635; 8 2.794,1.905
FUSE_5MM = drill 2.54 pad 3.556: 1 0,-10; 2 0,-4.158; 3 0,4.158; 4 0,10
DS2Y = drill 0.9: 1 -8.89,-3.81; 4 -1.27,-3.81; 6 3.81,-3.81; 8 8.89,-3.81; 9 8.89,3.81; 11 3.81,3.81; 13 -1.27,3.81; 16 -8.89,3.81
DPAK = smd 1.6 x 3: 1 -2.28,-5.31; 3 2.28,-5.31 | smd 4.826 x 5.715: 4 0,1.588
0603-RES = smd 1.1 x 1: 1 -0.85,0; 2 0.85,0
0603-RES@1 = smd 1.1 x 1: 1 -0.85,0; 2 0.85,0
0805 = smd 0.8 x 1.2: 1 -0.9,0; 2 0.9,0
SMKDSP_1,5/2 = drill 1.6 pad 1.8 long: 1 -2.5,0; 2 2.5,0
BUZZER-12MM-NS = drill 0.9: + 3.25,0; - -3.25,0
TEENSY_3.0_BASIC-PGM = drill 0.965: 0 -7.62,13.97; 1 -7.62,11.43; 2 -7.62,8.89; 3 -7.62,6.35; 3.3V 7.62,11.43; 3.3V1 -2.54,-16.51; 4 -7.62,3.81; 5 -7.62,1.27; 6 -7.62,-1.27; 7 -7.62,-3.81; 8 -7.62,-6.35; 9 -7.62,-8.89; 10 -7.62,-11.43; 11 -7.62,-13.97; 12 -7.62,-16.51; 13 7.62,-16.51; 14/A0 7.62,-13.97; 15/A1 7.62,-11.43; 16/A2 7.62,-8.89; 17/A3 7.62,-6.35; 18/A4 7.62,-3.81; 19/A5 7.62,-1.27; 20/A6 7.62,1.27; 21/A7 7.62,3.81; 22/A8 7.62,6.35; 23/A9 7.62,8.89; AGND 7.62,13.97; GND -7.62,16.51; GND1 0,-16.51; RESET 5.08,-16.51; VBAT -5.08,-16.51; VIN 7.62,16.51
REE-0505S = drill 0.6: +VIN 2.54,5.08; +VOUT 15.24,5.08; -VIN 5.08,5.08; -VOUT 10.16,5.08
RELAY-G5V = drill 1.016: 1 5.08,2.54; 2 2.54,2.54; 5 -5.08,2.54; 6 -5.08,-2.54; 9 2.54,-2.54; 10 5.08,-2.54

### Placement (x,y rotation side)
74HC125M  41.4,62.36 270 top
C1  76.2,95.25 0 top
C2  23.37,100.97 90 top
C3  23.5,92.08 270 top
C4  91.44,95.25 180 top
C5  75.56,79.38 90 top
C6  32.26,101.22 270 top
C9  68.58,44.45 270 top
C10  57.28,39.75 0 top
CAN  7.62,113.03 270 top
CAN1  7.62,93.98 270 top
CONTACTOR_1  43.18,7.62 0 top
CONTACTOR_2  81.28,7.62 0 top
D1  76.2,86.87 180 top
D2  74.17,125.73 90 top
D3  31.75,112.9 0 top
D4  17.78,112.78 0 top
D5  24.38,96.52 90 top
D6  22.86,39.37 180 top
D7  16.51,20.32 90 top
D8  50.8,38.1 270 top
D9  63.5,44.45 180 top
D10  71.12,33.02 0 top
D11  55.88,33.02 0 top
D12  39.88,22.86 90 top
D13  50.8,48.26 90 top
F1  99.06,43.18 0 bottom
F2  31.75,15.24 90 bottom
F3  99.06,19.05 0 bottom
FAN_LEDS  106.68,21.59 90 top
FANS  106.68,93.98 90 top
GAUGES_APA102  106.68,69.85 90 top
H1  5.08,128.27 0 top
H2  109.22,128.27 0 top
H3  109.22,5.08 0 top
H4  5.08,5.08 0 top
IC1  83.82,92.71 180 top
IC2  72.39,80.01 180 top
IC3  45.72,74.93 270 top
IC6  57.15,36.83 270 top
IC7  69.85,40.64 270 top
J2  104.14,113.16 270 top
LM393M  31.24,62.36 270 top
ON  90.17,125.73 180 top
PACK_LEDS  106.68,45.72 90 top
PF1  100.33,10.92 270 bottom
PF2  81.28,13.97 0 bottom
PRECHARGE_FUSE  13.97,74.93 90 top
PRECHARGE_RELAY  22.86,50.8 90 top
PRECHARGE_RELAY1  22.86,27.94 90 top
Q1  92.71,45.72 270 top
Q2  92.71,53.34 270 top
Q3  92.71,60.96 270 top
Q4  92.71,21.59 270 top
Q5  92.71,29.21 270 top
Q6  92.71,36.83 270 top
Q7  58.42,128.27 0 top
Q8  96.52,104.14 270 top
Q9  44.45,44.45 90 top
Q11  31.75,22.86 90 top
Q13  62.23,26.67 0 top
Q14  77.47,25.4 0 top
R1  35.56,112.14 0 top
R2  22.86,114.3 0 top
R3  91.06,77.47 180 top
R4  36.83,114.3 0 top
R5  21.59,111.76 0 top
R6  91.06,82.55 180 top
R7  82.55,50.8 0 top
R8  82.55,48.26 0 top
R9  82.55,58.42 0 top
R10  25.4,100.97 270 top
R11  82.55,55.88 0 top
R12  25.4,92.08 90 top
R13  30.48,92.84 180 top
R14  82.55,66.04 0 top
R15  82.55,63.5 0 top
R16  82.55,26.67 0 top
R17  82.55,24.13 0 top
R18  82.55,34.29 0 top
R19  82.55,31.75 0 top
R20  82.55,41.91 0 top
R21  82.55,39.37 0 top
R22  77.47,90.17 90 top
R23  44.45,83.82 90 top
R24  38.86,69.98 270 top
R25  41.4,69.98 270 top
R26  48.26,80.01 90 top
R27  54.61,45.72 270 top
R28  59.69,46.99 270 top
R29  58.04,124.46 180 top
R30  55.12,125.35 270 top
R31  91.44,104.14 0 top
R32  91.44,101.6 0 top
R33  35.56,64.26 270 top
R34  48.26,44.45 90 top
R35  64.77,38.1 270 top
R36  22.86,63.5 180 top
R37  25.4,69.47 180 top
R38  27.69,64.64 270 top
R39  29.21,68.58 90 top
R40  36.83,35.56 90 top
R41  35.56,22.86 90 top
R42  31.75,31.75 180 top
R43  35.56,31.75 180 top
R44  49.53,33.02 270 top
R45  35.56,60.33 90 top
R46  62.23,22.86 0 top
R47  77.47,21.59 0 top
R48  39.37,17.78 0 top
R49  31.75,19.05 90 top
SBO_LOOP_1  35.56,125.73 180 top
SBO_LOOP_2  21.59,125.73 180 top
SG1  66.93,125.98 270 top
U5  30.48,96.52 90 top
U$1  62.23,109.22 270 top
U$2  99.06,67.31 180 bottom
U$4  [PROS_LOGO]  76.2,45.09 90 top
U$5  31.75,88.9 270 top
U$7  55.88,25.4 90 top
U$8  71.12,25.4 90 top
X1  67.31,7.62 0 top
X2  7.62,49.53 270 top
X3  7.62,21.59 270 top
X4  7.62,63.5 270 top
X5  7.62,35.56 270 top
X6  19.05,7.62 0 top

### Tracks (layer width: path | path; a pad name or v marks a point on that pad's centre or on a via)
3.3V  (1 unrouted)
5V  (via drill 0.6)
  Top 0.305: R33.1 v35.56,66.67 | R45.1 v35.56,57.78 35.56,57.15 36.83,55.88 44.45,55.88 45.21,56.64 74HC125M.14
  Top 0.61: R45.1 33.23,59.48 LM393M.8
  Top 0.813: U$5.+VOUT 36.83,72.39 35.56,71.12 v35.56,66.67
  Bottom 0.61: v35.56,66.67 v35.56,57.78
96V_IN_FUSED
  Top 0.305: R37.2 24.5,74.4 PRECHARGE_FUSE.1
  Bottom 2.54: PRECHARGE_FUSE.1 23.97,62.39 PRECHARGE_RELAY.8 30.48,55.88 30.48,38.1 29.21,36.83 PRECHARGE_RELAY1.8
+5V  (via drill 0.6)
  Top 0.305: R22.2 77.47,94.42 C1.+ | R27.1 v54.61,49.53 54.29,49.21 D13.2 | R28.1 v59.69,49.53 | D9.2 62.55,49.21 v62.23,49.53 | R1.1 33.04,112.14 D3.2 | D4.2 18.81,111.76 19.05,111.76 R5.1 | D6.C 24.44,39.67 PRECHARGE_RELAY.1 | v66.04,49.53 66.04,44.45 66.89,43.6 C9.2 68.62,43.56 70.48,43.56 71.15,42.9 IC7.5 | IC6.5 58.45,39.43 C10.2 v59.69,39.75 | R23.2 v44.45,87.63 | R26.2 v48.26,83.82 | D12.2 42.87,23.81 v43.81,22.86 | D8.2 49.21,37.15 48.26,38.1 48.26,40.64 49.53,41.91 v50.8,41.91 | D7.C 16.51,17.91 17.27,17.15 24.77,17.15 PRECHARGE_RELAY1.1
  Top 0.406: IC2.8 75.25,78.21 C5.1 78.53,78.53 v78.74,78.74
  Top 0.61: v33.02,109.22 33.02,111.48 D3.2 | 19.05,111.76 v19.05,109.22 | U5.3 31.12,97.16 30.48,97.79 v30.48,100.33 30.52,100.37 C6.2
  Top 0.813: D2.C 68.78,124.58 SG1.+ 66.85,122.73 | PRECHARGE_RELAY.1 v41.91,41.91
  Top 1.016: IC1.2 81.54,98.8 80.64,99.7 | 80.64,99.7 U$1.VIN | C1.+ 78.1,97.15 80.64,99.7
  Bottom 0.305: v59.69,39.75 59.82,39.75 62.48,42.42 62.48,49.28 v62.23,49.53 | F2.2 31.75,19.05 | v43.81,22.86 43.81,19.05
  Bottom 0.61: v30.48,100.33 30.48,109.22
  Bottom 0.813: SG1.+ 77.93,122.73 81.28,119.38 81.28,101.6 U$1.VIN | PRECHARGE_RELAY1.1 31.75,19.05 43.81,19.05 46.99,19.05 50.8,22.86 v50.8,41.91 | v44.45,87.63 43.18,88.9 43.18,106.68 40.64,109.22 v33.02,109.22 30.48,109.22 v19.05,109.22 | v44.45,87.63 v48.26,83.82 55.88,76.2 78.74,76.2 | U$5.+VIN 43.18,86.36 v44.45,87.63 | v50.8,41.91 50.8,45.72 v54.61,49.53 | v41.91,41.91 v50.8,41.91
  Bottom 1.676: v54.61,49.53 v59.69,49.53 v62.23,49.53 v66.04,49.53 76.2,49.53 78.74,52.07 78.74,76.2 v78.74,78.74 U$1.VIN
+12V
  Top 0.61: D10.C 67.31,33.02 66.04,31.75 66.04,29.21 67.31,27.94 U$8.2 | D11.C 52.07,33.02 50.8,31.75 50.8,29.21 52.07,27.94 U$7.2
  Bottom 1.422: 68.58,22.86 58.42,22.86 U$7.2 | 68.58,22.86 91.44,22.86 | U$8.2 68.58,22.86
  Bottom 1.676: F3.2 95.25,19.05 95.25,17.78 92.71,17.78
  Bottom 1.93: PF1.1 96.27,14.22 95.25,15.24 95.25,17.78 | PF2.1 88.9,13.97 92.71,17.78
  Bottom 2.54: ON.1 92.67,113.45
  Bottom 3.81: 96.56,91.48 96.52,91.44
  Bottom 6.452: FANS.1 96.56,91.48
  pour Bottom (isolate 0.305): 90.17,114.3 99.06,114.3 99.06,15.24 90.17,15.24
AGND  (via drill 0.6)
  Top 0.305: 36.83,31.75 R43.1 36.83,32.12 R40.1 | 74HC125M.4 41.4,66.17 v41.02,66.55 37.97,66.55 37.59,66.17 74HC125M.7 | R38.1 28.95,65.54 LM393M.4 | 44.45,68.58 45.21,67.82 74HC125M.1 45.21,62.99 43.94,61.72 74HC125M.13 43.94,57.91 43.18,57.15 41.02,57.15 40.13,58.04 74HC125M.10 | IC3.4 44.7,73.03 45.09,73.41 45.09,75.18 44.7,75.56 IC3.2
  Bottom 0.305: v41.02,66.55 41.15,66.55 41.91,67.31 43.18,67.31 44.45,68.58
  other vias: 23.5,52.2 18.41,68.71 15.88,63.63 3.18,69.98 29.84,76.33 44.45,69.85
  pour Top (isolate 1.016): 0,13.97 25.4,13.97 29.21,17.78 29.21,25.4 38.1,30.48 38.1,53.34 45.72,53.34 45.72,78.74 44.45,80.01 0,80.01
  pour Bottom (isolate 1.016): 0,13.97 25.4,13.97 29.21,17.78 29.21,25.4 38.1,30.48 38.1,53.34 45.72,53.34 45.72,78.74 44.45,80.01 0,80.01
  pour Bottom (isolate 1.016): 0,13.97 25.4,13.97 29.21,17.78 29.21,25.4 38.1,30.48 38.1,53.34 45.72,53.34 45.72,78.74 44.45,80.01 0,80.01
BUZZER  (via drill 0.6)
  Top 0.305: v60.96,124.46 R29.1
  Bottom 0.305: U$1.10 50.8,119.38 55.88,124.46 v60.96,124.46
CAN_RXD
  Top 0.305: U$1.4 66.04,110.49 62.87,107.32 40.01,107.32 38.1,105.41 38.1,100.33 36.2,98.43 U5.4
CAN_TXD
  Top 0.305: U$1.3 68.58,110.49 64.14,106.05 40.51,106.05 40.26,105.79 39.37,104.9 39.37,96.52 37.59,94.74 33.22,94.74
  Top 0.406: 33.22,94.74 U5.1
CAP_CHARGE_REF  (via drill 0.6)
  Top 0.305: v34.8,52.83 30.48,57.15 30.48,59.44 LM393M.6 30.48,59.69 30.48,60.96 31.88,62.36 LM393M.2 31.75,65.28 31.75,67.31 31.37,67.69 R39.1 | R40.2 v34.81,36.46 v34.8,36.45
  Bottom 0.305: v34.8,36.45 v34.8,52.83
CAP_CHARGE_V_CURR_1
  Top 0.305: R36.1 27.93,63.5 | LM393M.3 30.61,63.5 27.93,63.5 | 27.93,63.5 R38.2
CAP_CHARGE_V_CURR_2  (via drill 0.6)
  Top 0.305: R43.2 R42.1 33.02,32.12 v33.02,34.29 | LM393M.5 29.34,55.75 v33.02,52.07
  Bottom 0.305: v33.02,52.07 v33.02,34.29
CHARGE_1
  Top 0.305: U$1.14/A0 45.72,99.06 45.72,82.97 | 45.72,82.97 45.72,74.93 46.35,74.3 IC3.6 50.16,74.3 50.8,73.66 50.8,62.23 57.15,55.88 57.15,43.18 54.61,40.64 54.61,37.34 55.12,36.83 IC6.2 | 45.72,82.97 R23.1
CHARGE_2  (via drill 0.6)
  Top 0.305: v63.5,40.64 60.96,40.64 58.42,43.18 58.42,55.88 52.07,62.23 52.07,76.2 51.44,76.84 IC3.8 48.89,76.84 49.53,77.47 49.53,78.74 | U$1.15/A1 49.53,100.33 49.53,78.74 | IC7.2 v66.04,40.64 | R26.1 49.11,79.16 49.53,78.74
  Bottom 0.305: v63.5,40.64 v66.04,40.64
CHARGE_ISO_1
  Top 0.305: R25.2 41.4,67.69 42.67,66.42 74HC125M.3
CHARGE_ISO_2  (via drill 0.6)
  Top 0.305: 74HC125M.8 37.59,57.66 v38.1,57.15 | v38.86,67.69 R24.2
  Bottom 0.305: v38.1,57.15 38.1,66.93 v38.86,67.69
CONTACT_EN_1
  Top 0.305: R46.1 61.28,22.96 Q13.1 61.34,25.63 61.34,26.29 61.72,26.67 62.99,26.67 63.5,27.18 63.5,35.56 63.18,35.88 IC6.4
CONTACT_EN_2
  Top 0.305: R47.1 76.52,21.69 Q14.1 76.35,24.13 73.66,24.13 71.12,26.67 71.12,39.66 IC7.4
CONTACTOR_CLOSED_SENSE_1  (via drill 0.6)
  Top 0.305: U$1.18/A4 v58.42,63.5 | R44.1 49.53,34.29 52.07,36.83 52.07,37.93 D8.3 51.9,40.47 54.61,43.18 R27.2 54.7,44.96 55.37,44.96 55.88,45.47 55.88,54.61 v54.61,55.88
  Bottom 0.305: v58.42,63.5 58.42,59.69 v54.61,55.88
CONTACTOR_CLOSED_SENSE_2  (via drill 0.6)
  Top 0.305: R35.1 64.77,41.91 63.5,43.18 | 63.33,43.18 D9.3 63.5,43.18 | 63.5,43.18 62.23,43.18 60.96,44.45 60.96,45.72 | R28.2 60.54,46.14 60.96,45.72 | 60.96,45.72 v60.96,55.88 | U$1.19/A5 v60.96,64.77
  Bottom 0.305: v60.96,64.77 v60.96,55.88
CONTACTOR_GND
  Top 0.305: X1.1 64.77,7.62
  Top 1.676: U$7.10 57.15,30.48 55.88,29.21 55.88,16.51 64.77,7.62
  Bottom 1.422: U$7.10 62.23,30.48 64.77,33.02 71.12,33.02 U$8.10
FAN_PWM
  Top 0.305: U$1.23/A9 71.12,102.87 72.39,104.14 R31.1
FANS_B  (via drill 0.5)
  Top 0.305: v62.23,104.14 62.23,64.77 78.74,48.26 78.74,43.18 80.01,41.91 R20.1
  Bottom 0.305: v62.23,104.14 62.23,113.03 63.5,114.3 U$1.5
FANS_G  (via drill 0.5)
  Top 0.305: v59.69,104.14 59.69,63.5 76.2,46.99 76.2,38.1 80.01,34.29 R18.1
  Bottom 0.305: v59.69,104.14 59.69,113.03 60.96,114.3 U$1.6
FANS_R  (via drill 0.5)
  Top 0.305: v57.15,104.14 57.15,62.23 73.66,45.72 73.66,35.56 78.74,30.48 78.74,27.94 80.01,26.67 R16.1
  Bottom 0.305: v57.15,104.14 57.15,110.49 53.34,114.3 U$1.9
GND  (via drill 0.6)
  Top 0.305: 47.84,22.44 48.26,22.86
  Top 0.61: R34.2 45.65,45.3
  other vias: 13.97,130.81 49.53,130.81 76.2,130.81 41.91,104.14 85.09,45.72 85.09,36.83 85.09,29.21 85.09,80.01 85.09,74.93 44.45,29.21 82.55,29.21 83.82,20.32 82.55,36.83 78.74,39.37 82.55,53.34 82.55,60.96 62.23,20.32 73.66,6.35 110.49,13.97 36.83,15.24 97.79,123.19 109.22,116.84 109.22,109.22 76.2,113.03 69.85,106.68 45.72,125.73 38.1,110.49 43.18,36.83 48.39,70.1 63.5,52.7 68.45,36.07 47.5,25.15 36.83,96.52 19.05,106.68 48.26,96.52 52.07,93.98 34.29,104.14 20.32,90.17 16.51,86.36 19.05,99.06 39.37,92.71 111.76,63.5 111.76,87.63 101.6,120.65 102.87,114.3 101.6,106.68 111.76,97.79 27.94,85.09 82.55,45.72 85.09,69.85 101.6,86.36 99.06,130.81 85.09,60.96 85.09,53.34 81.28,20.32 50.67,75.56 76.2,119.38 60.96,121.92 73.66,90.17 48.26,60.96 35.56,25.4 10.16,10.16 100.33,3.81
  pour Bottom (isolate 0.305, rank 2): 0,0 0,133.35 114.3,133.35 114.3,0
  pour Top (isolate 0.305, rank 2): 0,0 0,133.35 114.3,133.35 114.3,0
LED_C  (via drill 0.5)
  Top 0.305: v69.85,77.47 70.67,77.47 IC2.5
  Bottom 0.305: U$1.13 45.72,90.17 58.42,77.47 v69.85,77.47
LED_D  (via drill 0.5)
  Top 0.305: IC2.2 72.72,80.34 v72.39,80.01
  Bottom 0.305: U$1.11 48.26,105.41 46.99,104.14 46.99,91.44 58.42,80.01 v72.39,80.01
N$1
  Top 0.305: SBO_LOOP_2.1 24.09,114.68 R2.2
N$2
  Top 0.305: R6.2 78.74,82.55 77.98,83.31 72.39,83.31 72.14,83.06 72.14,81.88 IC2.3
N$3
  Top 0.305: GAUGES_APA102.3 106.68,77.47 R3.1
N$4
  Top 0.305: SBO_LOOP_1.1 38.06,114.68 R4.2
N$5
  Top 0.305: R6.1 106.68,82.55 GAUGES_APA102.4
N$6
  Top 2.54: PACK_LEDS.2 96.8,48.22 Q1.4
N$7
  Bottom 0.305: 106.68,43.18 PACK_LEDS.1
  Bottom 3.81: F1.1 106.68,43.18
N$8
  Top 2.54: PACK_LEDS.3 94.42,53.22 Q2.4
N$9
  Top 0.254: R10.1 C2.2
N$10
  Top 0.254: R12.1 C3.2
N$11
  Top 2.54: PACK_LEDS.4 97.04,58.22 Q3.4
N$12
  Top 0.305: Q1.1 87.14,48.26 R8.2 R7.2
N$13
  Top 0.305: R9.2 R11.2 87.14,55.88 Q2.1
N$14
  Top 0.305: R13.2 29.08,92.84 27.94,93.98 27.94,94.54 U5.8
N$15
  Top 0.305: R14.2 R15.2 87.14,63.5 Q3.1
N$16
  Top 0.305: D1.A 77.7,89.09 R22.1
N$17
  Top 0.305: R3.2 78.74,77.47 78.11,76.84 72.39,76.84 72.06,77.16 IC2.6
N$18
  Top 0.813: Q7.3 58.56,129.23 SG1.- 69.28,126.88 D2.A
N$19
  Bottom 0.305: F3.1 102.87,19.05
  Bottom 3.81: 102.87,19.05 106.64,19.05 FAN_LEDS.1
N$20
  Top 2.54: 93.98,21.59 Q4.4 95.25,21.59 97.75,24.09 FAN_LEDS.2
N$21
  Top 2.54: 95.57,30.48 Q5.4 94.42,29.09 FAN_LEDS.3
N$22
  Top 2.54: FAN_LEDS.4 97.04,34.09 Q6.4
N$23
  Top 0.305: R16.2 R17.2 87.63,24.13 87.63,24.1 Q4.1
N$24
  Top 0.305: Q5.1 87.14,31.75 R19.2 R18.2
N$25
  Top 0.305: Q6.1 87.14,39.37 R21.2 R20.2
N$26
  Top 0.305: Q7.1 57.62,127.02 57.62,124.89 R29.2 55.16,124.46 R30.2
N$27
  Top 0.305: R31.2 92.71,104.14 | R32.2 R31.2 | Q8.1 93.24,105.09 R31.2
N$28
  Top 0.305: 106.56,101.6 FANS.3 104.02,104.14 Q8.3
N$29
  Bottom 0.305: 106.68,67.31 GAUGES_APA102.1
  Bottom 3.81: U$2.2 106.68,67.31
N$30
  Top 0.305: R39.2 R37.1
N$31
  Top 0.305: LM393M.7 31.88,60.71 32.35,61.17 R45.2 35.6,61.21 38.73,61.21 | 74HC125M.9 38.86,61.09 38.73,61.21 | 74HC125M.12 42.67,61.09 42.55,61.21 38.73,61.21
N$32
  Top 0.305: 41.27,70.95 R25.1 41.4,74.17 41.53,74.3 IC3.3
N$33
  Top 0.61: D10.A 74.93,33.02 76.2,31.75 76.2,27.94
  Top 0.813: U$8.9 76.2,27.94 77.3,26.67 Q14.3
N$34
  Top 0.305: 38.73,70.95 R24.1 38.86,76.2 39.5,76.84 IC3.1
N$35
  Top 0.305: 62.23,27.94 Q13.3
  Top 0.61: D11.A 59.69,33.02 60.96,31.75 60.96,27.94
  Top 0.813: U$7.9 60.96,27.94 62.23,27.94
N$36
  Top 0.305: X6.4 31.55,13.77 35.56,17.78 R48.1
N$37
  Top 0.305: X6.3 26.55,13 R49.1
N$38
  Bottom 1.676: 50.8,7.74 CONTACTOR_1.3
  Bottom 1.93: U$7.6 U$7.5 53.34,16.51 50.8,13.97 50.8,7.74
N$39
  Top 1.422: 68.62,20.28 U$8.5
  Top 1.676: 88.9,7.74 CONTACTOR_2.3 | U$8.5 U$8.6 | 88.9,11.43 88.9,8.89
  Top 1.93: 88.9,10.16 88.9,8.89 88.9,7.74 | U$8.6 73.66,16.51 74.93,15.24 85.09,15.24 88.9,11.43
N$40
  Bottom 1.676: 19.01,49.49 PRECHARGE_RELAY.13
  Bottom 2.184: 15.28,52.03 17.78,49.53 PRECHARGE_RELAY.13 | 15.28,52.03 X2.1 15.28,52.03
N$41
  Bottom 0.305: 19.01,26.63 PRECHARGE_RELAY1.13
  Bottom 2.184: X3.1 16.47,24.09 | 16.47,24.09 PRECHARGE_RELAY1.13 | X3.1 16.47,24.09 | X3.1 16.47,24.09
N$42
  Bottom 2.184: X4.1 7.62,72.74 PRECHARGE_FUSE.3
N$43
  Bottom 0.305: CONTACTOR_1.4 55.68,8.69 55.88,8.89
  Bottom 1.93: PF2.2 58.42,13.97 55.88,11.43 55.88,8.89 55.88,7.62
N$44
  Bottom 1.676: PF1.2
  Bottom 1.93: CONTACTOR_2.4 PF1.2
N$45
  Top 0.305: R35.2 64.77,15.24 67.31,12.7 82.55,12.7 83.82,11.43 83.82,7.66 CONTACTOR_2.2
N$46
  Top 0.305: R44.2 49.53,16.51 45.72,12.7 45.72,7.66 CONTACTOR_1.2
N$47
  Bottom 0.305: F2.1 31.62,13.84 29.21,11.43 22.86,11.43 21.59,10.16 21.59,7.62 X6.2
PACK_B
  Top 0.305: U$1.22/A8 68.58,68.58 70.99,66.17 81.57,66.17 R14.1
PACK_G
  Top 0.305: R9.1 81.28,58.42 | 81.15,58.42 R9.1 | R9.1 74.93,58.42 66.04,67.31 U$1.21/A7
PACK_R
  Top 0.305: 81.28,50.8 R7.1 78.74,50.8 64.14,65.41 63.63,65.91 63.5,66.04 U$1.20/A6
PIN2
  Top 0.254: D5.2 25.7,97.16 U5.6
  Top 0.305: CAN.2 10.12,110.53 12.7,107.95 12.7,91.48 | CAN1.2 12.7,91.48 | 12.7,91.48 14.65,91.48 20.57,97.41 25.32,97.41 D5.2 25.4,97.49 R10.2
PIN7
  Top 0.254: U5.7 25.7,95.89 D5.1 25.4,95.55 25.4,95.25
  Top 0.305: CAN1.3 7.99,86.48 | CAN.3 7.62,102.87 3.81,99.06 3.81,90.17 7.62,86.36 7.87,86.36 7.99,86.48 | 25.4,95.25 R12.2 | 7.99,86.48 12.44,86.48 21.59,95.63 25.32,95.63 D5.1
PRECH_DRAIN
  Top 0.305: PRECHARGE_RELAY.16 19.05,41.61 D6.A
  Top 0.813: Q9.3 21.59,44.45 PRECHARGE_RELAY.16
PRECH_DRAIN1
  Top 0.305: PRECHARGE_RELAY1.16 19.05,18.75 | D7.A 18.75,21.9 20.32,20.32
  Top 0.813: Q11.3 22.86,22.86 20.32,20.32 PRECHARGE_RELAY1.16
PRECH_STATE_TO_BUFF
  Top 0.305: 40.13,63.5 40.13,63.37 35.6,63.37 R33.2 35.52,63.37 33.4,63.37 33.15,63.63 LM393M.1 | 40.13,63.5 74HC125M.5 | 74HC125M.2 43.94,63.5 43.81,63.37 40.26,63.37 40.13,63.5
PRECHARGE_EN_1  (via drill 0.6)
  Top 0.305: U$1.17/A3 v55.88,60.96 | v52.07,57.15 52.07,53.34 49.7,50.97 D13.3 49.7,43.86 49.4,43.56 48.3,43.56 R34.1 48.16,43.5 Q9.1 45.55,19.52 43.81,17.78 R48.2
  Bottom 0.305: v55.88,60.96 v52.07,57.15
PRECHARGE_EN_2  (via drill 0.6)
  Top 0.305: U$1.16/A2 53.34,100.33 54.61,99.06 v54.61,63.5 | 31.75,19.54 R49.2 31.75,20.81 Q11.1 32.95,22.01 R41.1 37.93,22.01 D12.3 38.78,24.55 v40.13,25.91
  Bottom 0.305: v54.61,63.5 48.26,57.15 48.26,52.07 46.99,50.8 41.91,50.8 40.64,49.53 40.64,26.42 v40.13,25.91
PRECHARGE_OUT_1
  Top 0.305: R36.2 20.32,63.5 19.05,62.23 PRECHARGE_RELAY.9
  Top 2.184: X5.1 12.66,38.06 15.24,40.64 15.24,55.88 PRECHARGE_RELAY.9
  Bottom 2.184: PRECHARGE_RELAY.9 21.59,59.69 PRECHARGE_RELAY.6
PRECHARGE_OUT_2
  Top 0.305: PRECHARGE_RELAY1.6 R42.2
  Bottom 1.676: PRECHARGE_RELAY1.9 17.78,36.83 | 7.66,33.02 X5.2
  Bottom 2.184: PRECHARGE_RELAY1.9 21.59,36.83 PRECHARGE_RELAY1.6 | 17.78,36.83 13.97,33.02 7.66,33.02
PRECHARGE_RESISTOR_IN_1
  Bottom 2.184: X2.2 13.93,47.03 15.24,45.72 22.86,45.72 PRECHARGE_RELAY.4
PRECHARGE_RESISTOR_IN_2
  Bottom 2.184: X3.2 11.47,19.09 13.97,21.59 21.59,21.59 PRECHARGE_RELAY1.4
SBO_SENSE_1
  Top 0.305: 35.94,114.26 R4.1 | U$1.7 58.42,119.38 57.15,120.65 43.18,120.65 40.64,118.11 40.64,113.41 39.62,112.4 36.66,112.4 | R4.1 35.68,114 D3.3 | 36.66,112.4 R1.2 | 36.66,112.4 36.32,112.4 36.2,112.27 36.07,112.27 36.07,114.21 R4.1
SBO_SENSE_2
  Top 0.305: U$1.8 55.88,118.11 54.61,119.38 44.45,119.38 41.91,116.84 41.91,109.22 40.64,107.95 22.73,107.95 21.97,108.71 21.97,111.29 R5.2 22.01,112.19 R2.1 18.2,114.3 D4.3
VCC  (via drill 0.6)
  Top 1.016: IC1.1 86.1,97.53 v87.63,99.06 | v87.63,99.06 v87.63,101.6 | C4.+ 89.54,97.15 v87.63,99.06
  Bottom 2.54: v87.63,101.6 87.63,125.69 ON.2

### Text on the board
tPlace: 12V IN | SBO LOOP 2 | SBO LOOP 1 | ON SWITCH | CAN | IN | IN | ON | GND | GND | GND | GND | 12V | GND | L | 12V | H | PWM | CAN | GND | GND | L | 12V | FANS | H | PWR | CO | DO | GND | 96V PACK | 12V | 96V+ | APA102 | GND | R | PRECHARGE R1 | G | R | B | R | + | PRECHARGE OUT | FANS RGB | PC1 | R | PC2 | G | PRECHARGE R2 | R | B | R | + | GND | EN2 | EN1 | RE- | RE+ | GND | RE- | RE+ | 5V | SL | SL | EN | SL | SL | PACK RGB | PRE CHG EN | CONTACTOR 1 | CONTACT EN | CONTACTOR 2
tNames: Pack Control Rev. 1 | High Voltage!